# EAGLE design TSC_proiect (EAGLE 9.7.0)

## Sheet 1 of 2
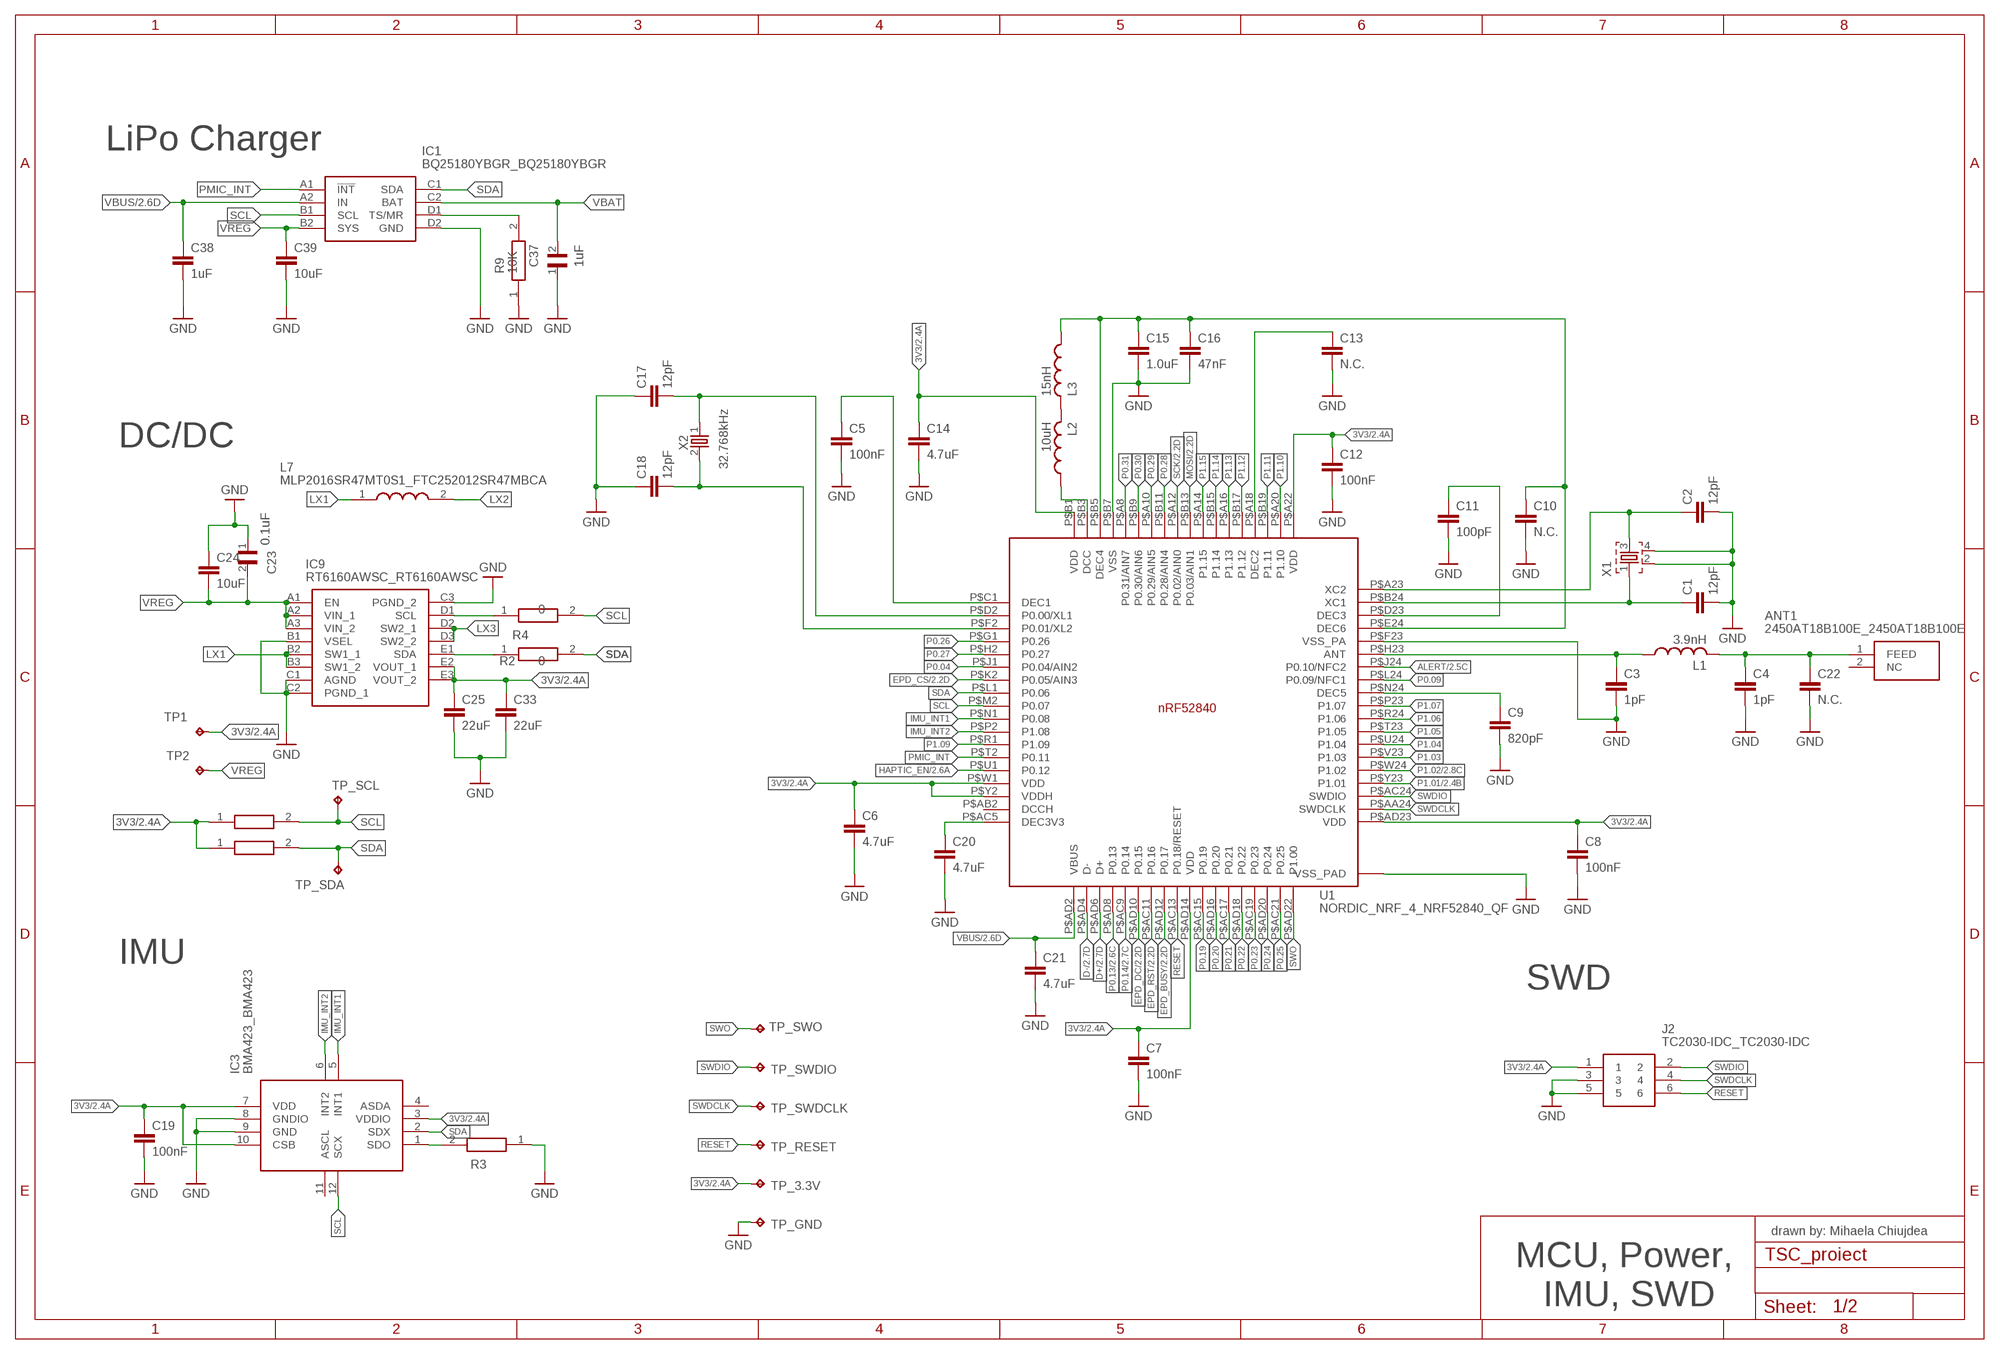
[diagram p0: schematic, sheet 1]

### Parts
ANT1  2450AT18B100E_2450AT18B100E  [2450AT18B100E_ANTC3216X140N]
C1  12pF  NORDIC_NRF_3_CAPACITOR_0201_L  [NORDIC_NRF_3_RESC0201_L]
C2  12pF  NORDIC_NRF_3_CAPACITOR_0201_L  [NORDIC_NRF_3_RESC0201_L]
C3  1pF  NORDIC_NRF_3_CAPACITOR_0201_L  [NORDIC_NRF_3_RESC0201_L]
C4  1pF  NORDIC_NRF_3_CAPACITOR_0201_L  [NORDIC_NRF_3_RESC0201_L]
C5  100nF  NORDIC_NRF_3_CAPACITOR_0201_L  [NORDIC_NRF_3_RESC0201_L]
C6  4.7uF  NORDIC_NRF_3_CAPACITOR_0201_L  [NORDIC_NRF_3_RESC0201_L]
C7  100nF  NORDIC_NRF_3_CAPACITOR_0201_L  [NORDIC_NRF_3_RESC0201_L]
C8  100nF  NORDIC_NRF_3_CAPACITOR_0201_L  [NORDIC_NRF_3_RESC0201_L]
C9  820pF  NORDIC_NRF_3_CAPACITOR_0201_L  [NORDIC_NRF_3_RESC0201_L]
C10  N.C.  NORDIC_NRF_3_CAPACITOR_0201_L  [NORDIC_NRF_3_RESC0201_L]
C11  100pF  NORDIC_NRF_3_CAPACITOR_0201_L  [NORDIC_NRF_3_RESC0201_L]
C12  100nF  NORDIC_NRF_3_CAPACITOR_0201_L  [NORDIC_NRF_3_RESC0201_L]
C13  N.C.  NORDIC_NRF_3_CAPACITOR_0201_L  [NORDIC_NRF_3_RESC0201_L]
C14  4.7uF  NORDIC_NRF_3_CAPACITOR_0201_L  [NORDIC_NRF_3_RESC0201_L]
C15  1.0uF  NORDIC_NRF_3_CAPACITOR_0201_L  [NORDIC_NRF_3_RESC0201_L]
C16  47nF  NORDIC_NRF_3_CAPACITOR_0201_L  [NORDIC_NRF_3_RESC0201_L]
C17  12pF  NORDIC_NRF_3_CAPACITOR_0201_L  [NORDIC_NRF_3_RESC0201_L]
C18  12pF  NORDIC_NRF_3_CAPACITOR_0201_L  [NORDIC_NRF_3_RESC0201_L]
C19  100nF  NORDIC_NRF_3_CAPACITOR_0201_L  [NORDIC_NRF_3_RESC0201_L]
C20  4.7uF  NORDIC_NRF_3_CAPACITOR_0201_L  [NORDIC_NRF_3_RESC0201_L]
C21  4.7uF  NORDIC_NRF_3_CAPACITOR_0201_L  [NORDIC_NRF_3_RESC0201_L]
C22  N.C.  NORDIC_NRF_3_CAPACITOR_0201_L  [NORDIC_NRF_3_RESC0201_L]
C23  0.1uF  GRM011R60J152KE01L_2_GRM011R60J152KE01L  [GRM011R60J152KE01L_2_CAPC0201X13N]
C24  10uF  NORDIC_NRF_3_CAPACITOR_0201_L  [NORDIC_NRF_3_RESC0201_L]
C25  22uF  NORDIC_NRF_3_CAPACITOR_0201_L  [NORDIC_NRF_3_RESC0201_L]
C33  22uF  NORDIC_NRF_3_CAPACITOR_0201_L  [NORDIC_NRF_3_RESC0201_L]
C37  1uF  GRM011R60J152KE01L_2_GRM011R60J152KE01L  [GRM011R60J152KE01L_2_CAPC0201X13N]
C38  1uF  NORDIC_NRF_3_CAPACITOR_0201_L  [NORDIC_NRF_3_RESC0201_L]
C39  10uF  NORDIC_NRF_3_CAPACITOR_0201_L  [NORDIC_NRF_3_RESC0201_L]
IC1  BQ25180YBGR_BQ25180YBGR  [BQ25180YBGR_BGA8C40P2X4_100X155X50]
IC3  BMA423_BMA423  [BMA423_BMA423]
IC9  RT6160AWSC_RT6160AWSC  [RT6160AWSC_BGA15C40P3X5_140X230X60]
J2  TC2030-IDC_TC2030-IDC  [TC2030-IDC_TC2030IDC]
L1  3.9nH  NORDIC_NRF_2_INDUCTOR_0402_L  [NORDIC_NRF_2_RESC0402_L]
L2  10uH  NORDIC_NRF_2_INDUCTOR_0402_L  [NORDIC_NRF_2_RESC0402_L]
L3  15nH  NORDIC_NRF_2_INDUCTOR_0402_L  [NORDIC_NRF_2_RESC0402_L]
L7  MLP2016SR47MT0S1_FTC252012SR47MBCA  [MLP2016SR47MT0S1_INDC2016X100N]
R2  0  CPF0201D7K68C1_CPF0201D7K68C1  [CPF0201D7K68C1_0201]
R3  CPF0201D7K68C1_CPF0201D7K68C1  [CPF0201D7K68C1_0201]
R4  0  CPF0201D7K68C1_CPF0201D7K68C1  [CPF0201D7K68C1_0201]
R9  10K  CPF0201D7K68C1_CPF0201D7K68C1  [CPF0201D7K68C1_0201]
R17  CPF0201D7K68C1_CPF0201D7K68C1  [CPF0201D7K68C1_0201]
R18  CPF0201D7K68C1_CPF0201D7K68C1  [CPF0201D7K68C1_0201]
TP1  HECTOR_WATCH_1_TPTP20R  [HECTOR_WATCH_1_TP20R]
TP2  HECTOR_WATCH_1_TPTP20R  [HECTOR_WATCH_1_TP20R]
TP_3.3V  HECTOR_WATCH_1_TPTP20R  [HECTOR_WATCH_1_TP20R]
TP_GND  HECTOR_WATCH_1_TPTP20R  [HECTOR_WATCH_1_TP20R]
TP_RESET  HECTOR_WATCH_1_TPTP20R  [HECTOR_WATCH_1_TP20R]
TP_SCL  HECTOR_WATCH_1_TPTP20R  [HECTOR_WATCH_1_TP20R]
TP_SDA  HECTOR_WATCH_1_TPTP20R  [HECTOR_WATCH_1_TP20R]
TP_SWDCLK  HECTOR_WATCH_1_TPTP20R  [HECTOR_WATCH_1_TP20R]
TP_SWDIO  HECTOR_WATCH_1_TPTP20R  [HECTOR_WATCH_1_TP20R]
TP_SWO  HECTOR_WATCH_1_TPTP20R  [HECTOR_WATCH_1_TP20R]
U1  NORDIC_NRF_4_NRF52840_QF  [NORDIC_NRF_4_AQFN50P700X700X85_HS-74N]
X1  NORDIC_NRF_XTAL_32MHZ  [NORDIC_NRF_BT-XTAL_2016_N]
X2  32.768kHz  NORDIC_NRF_1_XTAL_32KHZ  [NORDIC_NRF_1_XTAL_3215_N]

### Nets
3V3/2.4A: C6.1 C7.1 C8.1 C12.1 C14.1 C19.1 C25.1 C33.1 IC3.3(VDDIO) IC3.7(VDD) IC3.10(CSB) IC9.E2(VOUT_1) IC9.E3(VOUT_2) J2.1 R17.1 R18.1 TP1.TP TP_3.3V.TP U1.P$A22(VDD) U1.P$AD14(VDD) U1.P$AD23(VDD) U1.P$B1(VDD) U1.P$W1(VDD) U1.P$Y2(VDDH)
22UF: C25.2 C33.2 ; supply symbol labelled GND
ALERT/2.5C: U1.P$J24(P0.10/NFC2)
D+/2.7D: U1.P$AD6(D+)
D-/2.7D: U1.P$AD4(D-)
EPD_BUSY/2.2D: U1.P$AD12(P0.17)
EPD_CS/2.2D: U1.P$K2(P0.05/AIN3)
EPD_DC/2.2D: U1.P$AD10(P0.15)
EPD_RST/2.2D: U1.P$AC11(P0.16)
GND: C1.2 C2.2 C3.2 C4.2 C5.2 C6.2 C7.2 C8.2 C9.2 C10.2 C11.2 C12.2 C13.2 C14.2 C15.2 C16.2 C17.1 C18.1 C19.2 C20.2 C21.2 C22.2 C23.1 C24.1 C37.1 C38.2 C39.2 IC1.D2(GND) IC3.8(GNDIO) IC3.9(GND) IC9.B1(VSEL) IC9.C1(AGND) IC9.C2(PGND_1) IC9.C3(PGND_2) J2.3 J2.5 R3.1 R9.1 U1.P$74(VSS_PAD) U1.P$75(VSS_PAD) U1.P$76(VSS_PAD) U1.P$77(VSS_PAD) U1.P$78(VSS_PAD) U1.P$79(VSS_PAD) U1.P$80(VSS_PAD) U1.P$81(VSS_PAD) U1.P$82(VSS_PAD) U1.P$83(VSS_PAD) U1.P$84(VSS_PAD) U1.P$85(VSS_PAD) U1.P$86(VSS_PAD) U1.P$87(VSS_PAD) U1.P$88(VSS_PAD) U1.P$89(VSS_PAD) U1.P$90(VSS_PAD) U1.P$B7(VSS) U1.P$F23(VSS_PA) X1.2 X1.4 ; also sheet 2
HAPTIC_EN/2.6A: U1.P$U1(P0.12)
IMU_INT1: IC3.5(INT1) U1.P$N1(P0.08)
IMU_INT2: IC3.6(INT2) U1.P$P2(P1.08)
LX1: IC9.B2(SW1_1) IC9.B3(SW1_2) L7.1
LX2: L7.2
LX3: IC9.D2(SW2_1) IC9.D3(SW2_2)
MOSI/2.2D: U1.P$B13(P0.03/AIN1)
N$1: IC1.D1(TS/MR) R9.2
N$2: IC9.D1(SCL) R4.1
N$3: IC9.E1(SDA) R2.1
N$4: C20.1 U1.P$AC5(DEC3V3)
N$5: C9.1 U1.P$N24(DEC5)
N$6: C3.1 L1.1 U1.P$H23(ANT)
N$7: ANT1.1(FEED) C4.1 C22.1 L1.2
N$8: C1.1 U1.P$B24(XC1) X1.1
N$9: C2.1 U1.P$A23(XC2) X1.3
N$10: C11.1 U1.P$D23(DEC3)
N$11: C13.1 U1.P$A18(DEC2)
N$12: L2.2 L3.2
N$13: L2.1 U1.P$B3(DCC)
N$14: C10.1 C15.1 C16.1 L3.1 U1.P$B5(DEC4) U1.P$E24(DEC6)
N$15: C5.1 U1.P$C1(DEC1)
N$16: C17.2 U1.P$D2(P0.00/XL1) X2.1
N$17: C18.2 U1.P$F2(P0.01/XL2) X2.2
N$19: IC3.1(SDO) R3.2
N$24: TP_GND.TP ; supply symbol labelled GND
P0.04: U1.P$J1(P0.04/AIN2)
P0.09: U1.P$L24(P0.09/NFC1)
P0.13/2.6C: U1.P$AD8(P0.13)
P0.14/2.7C: U1.P$AC9(P0.14)
P0.19: U1.P$AC15(P0.19)
P0.20: U1.P$AD16(P0.20)
P0.21: U1.P$AC17(P0.21)
P0.22: U1.P$AD18(P0.22)
P0.23: U1.P$AC19(P0.23)
P0.24: U1.P$AD20(P0.24)
P0.25: U1.P$AC21(P0.25)
P0.26: U1.P$G1(P0.26)
P0.27: U1.P$H2(P0.27)
P0.28: U1.P$B11(P0.28/AIN4)
P0.29: U1.P$A10(P0.29/AIN5)
P0.30: U1.P$B9(P0.30/AIN6)
P0.31: U1.P$A8(P0.31/AIN7)
P1.01/2.4B: U1.P$Y23(P1.01)
P1.02/2.8C: U1.P$W24(P1.02)
P1.03: U1.P$V23(P1.03)
P1.04: U1.P$U24(P1.04)
P1.05: U1.P$T23(P1.05)
P1.06: U1.P$R24(P1.06)
P1.07: U1.P$P23(P1.07)
P1.09: U1.P$R1(P1.09)
P1.10: U1.P$A20(P1.10)
P1.11: U1.P$B19(P1.11)
P1.12: U1.P$B17(P1.12)
P1.13: U1.P$A16(P1.13)
P1.14: U1.P$B15(P1.14)
P1.15: U1.P$A14(P1.15)
PMIC_INT: IC1.A1(!INT) U1.P$T2(P0.11)
RESET: J2.6 TP_RESET.TP U1.P$AC13(P0.18/RESET)
SCK/2.2D: U1.P$A12(P0.02/AIN0)
SCL: IC1.B1(SCL) IC3.12(SCX) R4.2 R17.2 TP_SCL.TP U1.P$M2(P0.07)
SDA: IC1.C1(SDA) IC3.2(SDX) R2.2 R18.2 TP_SDA.TP U1.P$L1(P0.06)
SWDCLK: J2.4 TP_SWDCLK.TP U1.P$AA24(SWDCLK)
SWDIO: J2.2 TP_SWDIO.TP U1.P$AC24(SWDIO)
SWO: TP_SWO.TP U1.P$AD22(P1.00)
VBAT: C37.2 IC1.C2(BAT)
VBUS/2.6D: C21.1 C38.1 IC1.A2(IN) U1.P$AD2(VBUS)
VREG: C23.2 C24.2 C39.1 IC1.B2(SYS) IC9.A1(EN) IC9.A2(VIN_1) IC9.A3(VIN_2) TP2.TP
Unconnected: ANT1.2(NC) IC3.4(ASDA) IC3.11(ASCL) U1.P$AB2(DCCH)

### Notes on the sheet
- LiPo Charger
- DC/DC
- IMU
- SWD
- drawn by: Mihaela Chiujdea
- MCU, Power, 
  IMU, SWD

## Sheet 2 of 2
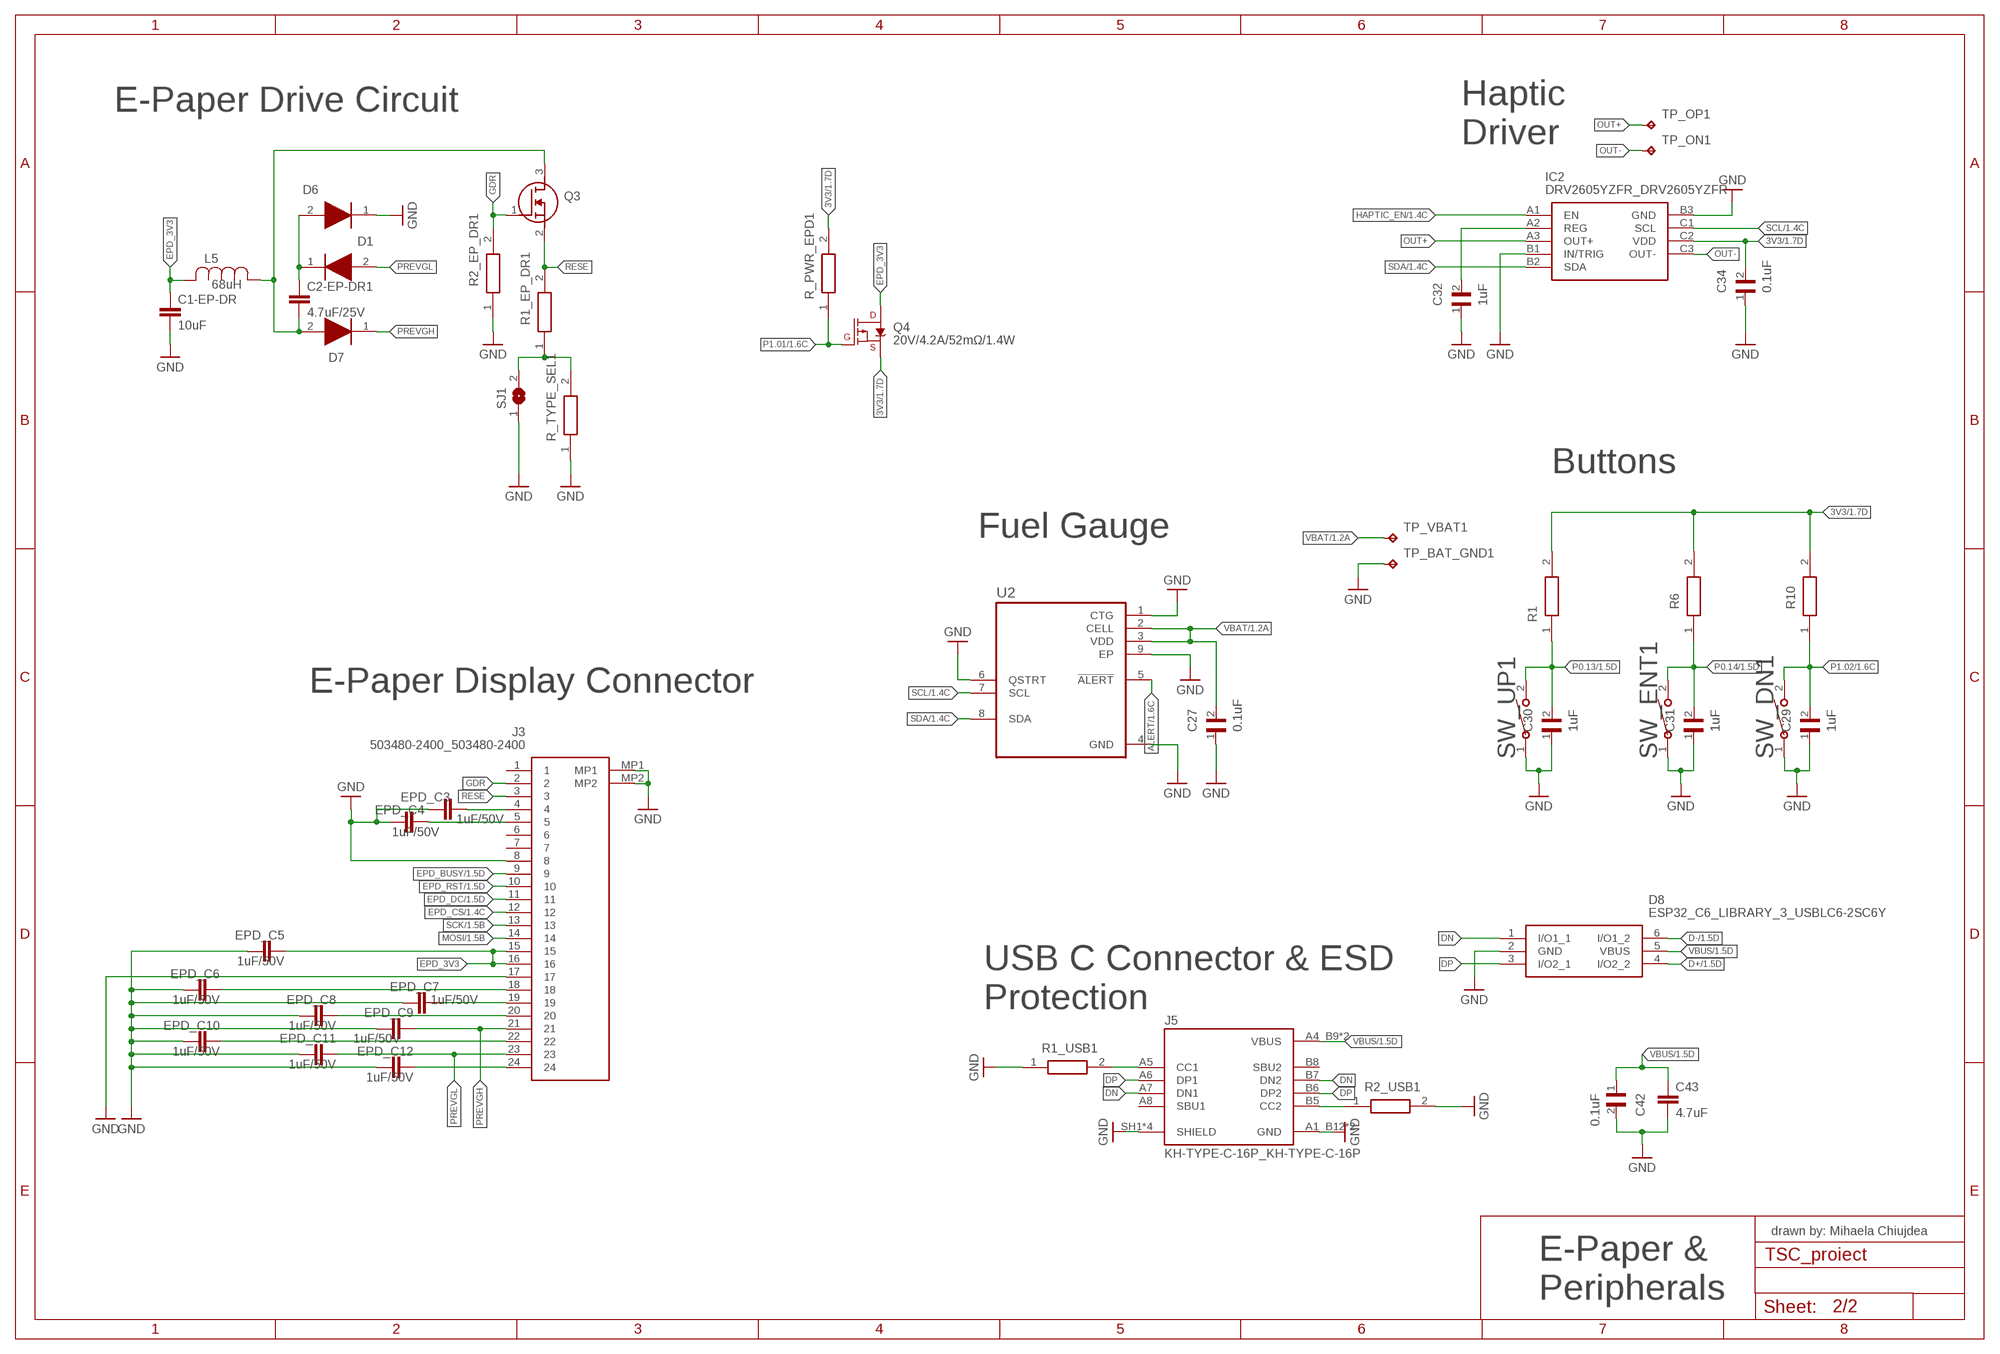
[diagram p1: schematic, sheet 2]

### Parts
C1-EP-DR  10uF  NORDIC_NRF_3_CAPACITOR_0201_L  [NORDIC_NRF_3_RESC0201_L]
C2-EP-DR1  4.7uF/25V  NORDIC_NRF_3_CAPACITOR_0201_L  [NORDIC_NRF_3_RESC0201_L]
C27  0.1uF  GRM011R60J152KE01L_2_GRM011R60J152KE01L  [GRM011R60J152KE01L_2_CAPC0201X13N]
C29  1uF  GRM011R60J152KE01L_2_GRM011R60J152KE01L  [GRM011R60J152KE01L_2_CAPC0201X13N]
C30  1uF  GRM011R60J152KE01L_2_GRM011R60J152KE01L  [GRM011R60J152KE01L_2_CAPC0201X13N]
C31  1uF  GRM011R60J152KE01L_2_GRM011R60J152KE01L  [GRM011R60J152KE01L_2_CAPC0201X13N]
C32  1uF  GRM011R60J152KE01L_2_GRM011R60J152KE01L  [GRM011R60J152KE01L_2_CAPC0201X13N]
C34  0.1uF  GRM011R60J152KE01L_2_GRM011R60J152KE01L  [GRM011R60J152KE01L_2_CAPC0201X13N]
C42  0.1uF  GRM011R60J152KE01L_2_GRM011R60J152KE01L  [GRM011R60J152KE01L_2_CAPC0201X13N]
C43  4.7uF  NORDIC_NRF_3_CAPACITOR_0201_L  [NORDIC_NRF_3_RESC0201_L]
D1  ESP32_C6_LIBRARY_5_MBR0530  [ESP32_C6_LIBRARY_5_SOD3716X135N]
D6  ESP32_C6_LIBRARY_5_MBR0530  [ESP32_C6_LIBRARY_5_SOD3716X135N]
D7  ESP32_C6_LIBRARY_5_MBR0530  [ESP32_C6_LIBRARY_5_SOD3716X135N]
D8  ESP32_C6_LIBRARY_3_USBLC6-2SC6Y  [ESP32_C6_LIBRARY_3_SOT95P280X145-6N]
EPD_C3  1uF/50V  NORDIC_NRF_3_CAPACITOR_0201_L  [NORDIC_NRF_3_RESC0201_L]
EPD_C4  1uF/50V  NORDIC_NRF_3_CAPACITOR_0201_L  [NORDIC_NRF_3_RESC0201_L]
EPD_C5  1uF/50V  NORDIC_NRF_3_CAPACITOR_0201_L  [NORDIC_NRF_3_RESC0201_L]
EPD_C6  1uF/50V  NORDIC_NRF_3_CAPACITOR_0201_L  [NORDIC_NRF_3_RESC0201_L]
EPD_C7  1uF/50V  NORDIC_NRF_3_CAPACITOR_0201_L  [NORDIC_NRF_3_RESC0201_L]
EPD_C8  1uF/50V  NORDIC_NRF_3_CAPACITOR_0201_L  [NORDIC_NRF_3_RESC0201_L]
EPD_C9  1uF/50V  NORDIC_NRF_3_CAPACITOR_0201_L  [NORDIC_NRF_3_RESC0201_L]
EPD_C10  1uF/50V  NORDIC_NRF_3_CAPACITOR_0201_L  [NORDIC_NRF_3_RESC0201_L]
EPD_C11  1uF/50V  NORDIC_NRF_3_CAPACITOR_0201_L  [NORDIC_NRF_3_RESC0201_L]
EPD_C12  1uF/50V  NORDIC_NRF_3_CAPACITOR_0201_L  [NORDIC_NRF_3_RESC0201_L]
IC2  DRV2605YZFR_DRV2605YZFR  [DRV2605YZFR_BGA9C50P3X3_144X144X62]
J3  503480-2400_503480-2400  [503480-2400_5034802400]
J5  KH-TYPE-C-16P_KH-TYPE-C-16P  [KH-TYPE-C-16P_KINGHELM_KH-TYPE-C-16P]
L5  68uH  ESP32_C6_LIBRARY_2_744043680IND_4828-WE-TPC_WRE  [ESP32_C6_LIBRARY_2_IND_4828-WE-TPC_WRE]
Q3  ESP32_C6_LIBRARY_6_SI1308EDL-T1-GE3  [ESP32_C6_LIBRARY_6_SOT65P210X110-3N]
Q4  20V/4.2A/52mΩ/1.4W  ESP32_C6_LIBRARY_4_ESP32_WROVER_SPARKFUN-DISCRETESEMI_MOSFET_PCH-DMG2305UX-7  [ESP32_C6_LIBRARY_4_ESP32_C6_LIBRARY_4_ESP32_C6_LIBRARY_4_ESP32_C6_LIBRARY_4_ESP32_WROVER_SPARKFUN-DISCRETESEMI_SOT23-3]
R1  CPF0201D7K68C1_CPF0201D7K68C1  [CPF0201D7K68C1_0201]
R1_EP_DR1  CPF0201D7K68C1_CPF0201D7K68C1  [CPF0201D7K68C1_0201]
R1_USB1  5K1  CPF0201D7K68C1_CPF0201D7K68C1  [CPF0201D7K68C1_0201]
R2_EP_DR1  CPF0201D7K68C1_CPF0201D7K68C1  [CPF0201D7K68C1_0201]
R2_USB1  CPF0201D7K68C1_CPF0201D7K68C1  [CPF0201D7K68C1_0201]
R6  CPF0201D7K68C1_CPF0201D7K68C1  [CPF0201D7K68C1_0201]
R10  CPF0201D7K68C1_CPF0201D7K68C1  [CPF0201D7K68C1_0201]
R_PWR_EPD1  CPF0201D7K68C1_CPF0201D7K68C1  [CPF0201D7K68C1_0201]
R_TYPE_SEL1  CPF0201D7K68C1_CPF0201D7K68C1  [CPF0201D7K68C1_0201]
SJ1  ESP32_C6_LIBRARY_7_JUMPER_SJ  [ESP32_C6_LIBRARY_7_JUMPER_SJ]
SW_DN1  2025-10-22_07-23-44_LIBRARY_EVP-AKE31ASW_EVP-AKE31A_PAN  [2025-10-22_07-23-44_LIBRARY_SW_EVP-AKE31A_PAN]
SW_ENT1  2025-10-22_07-23-44_LIBRARY_EVP-AKE31ASW_EVP-AKE31A_PAN  [2025-10-22_07-23-44_LIBRARY_SW_EVP-AKE31A_PAN]
SW_UP1  2025-10-22_07-23-44_LIBRARY_EVP-AKE31ASW_EVP-AKE31A_PAN  [2025-10-22_07-23-44_LIBRARY_SW_EVP-AKE31A_PAN]
TP_BAT_GND1  HECTOR_WATCH_1_TPTP20R  [HECTOR_WATCH_1_TP20R]
TP_ON1  HECTOR_WATCH_1_TPTP20R  [HECTOR_WATCH_1_TP20R]
TP_OP1  HECTOR_WATCH_1_TPTP20R  [HECTOR_WATCH_1_TP20R]
TP_VBAT1  HECTOR_WATCH_1_TPTP20R  [HECTOR_WATCH_1_TP20R]
U2  ESP32_C6_LIBRARY_MAX17048G+T10  [ESP32_C6_LIBRARY_SON50P200X200X80-9N]

### Nets
3V3/1.7D: C34.2 IC2.C2(VDD) Q4.2(S) R1.2 R6.2 R10.2 R_PWR_EPD1.2
ALERT/1.6C: U2.5(!ALERT)
D+/1.5D: D8.4(I/O2_2)
D-/1.5D: D8.6(I/O1_2)
DN: D8.1(I/O1_1) J5.A7(DN1) J5.B7(DN2)
DP: D8.3(I/O2_1) J5.A6(DP1) J5.B6(DP2)
EPD_3V3: C1-EP-DR.1 EPD_C5.2 J3.15 J3.16 L5.2 Q4.3(D)
EPD_BUSY/1.5D: J3.9
EPD_CS/1.4C: J3.12
EPD_DC/1.5D: J3.11
EPD_RST/1.5D: J3.10
GDR: J3.2 Q3.1(G) R2_EP_DR1.2
GND: C1-EP-DR.2 C27.1 C29.1 C30.1 C31.1 C32.1 C34.1 C42.2 C43.2 D6.1(K) D8.2(GND) EPD_C3.1 EPD_C4.1 EPD_C5.1 EPD_C6.1 EPD_C7.1 EPD_C8.1 EPD_C9.1 EPD_C10.1 EPD_C11.1 EPD_C12.1 IC2.B1(IN/TRIG) IC2.B3(GND) J3.8 J3.17 J3.MP1 J3.MP2 J5.A1_B12(GND) J5.A12_B1(GND) J5.SH1(SHIELD) J5.SH2(SHIELD) J5.SH3(SHIELD) J5.SH4(SHIELD) R1_USB1.1 R2_EP_DR1.1 R2_USB1.2 R_TYPE_SEL1.1 SJ1.1 SW_DN1.1 SW_ENT1.1 SW_UP1.1 TP_BAT_GND1.TP U2.1(CTG) U2.4(GND) U2.6(QSTRT) U2.9(EP) ; also sheet 1
HAPTIC_EN/1.4C: IC2.A1(EN)
MOSI/1.5B: J3.14
N$30: C2-EP-DR1.2 D7.2(A) L5.1 Q3.3(D)
N$32: C2-EP-DR1.1 D1.1(K) D6.2(A)
N$35: R1_EP_DR1.1 R_TYPE_SEL1.2 SJ1.2
N$36: C32.2 IC2.A2(REG)
N$37: EPD_C4.2 J3.5
N$38: EPD_C3.2 J3.4
N$39: EPD_C6.2 J3.18
N$40: EPD_C7.2 J3.19
N$41: EPD_C8.2 J3.20
N$42: EPD_C10.2 J3.22
N$43: EPD_C12.2 J3.24
N$44: J5.A5(CC1) R1_USB1.2
N$45: J5.B5(CC2) R2_USB1.1
OUT+: IC2.A3(OUT+) TP_OP1.TP
OUT-: IC2.C3(OUT-) TP_ON1.TP
P0.13/1.5D: C30.2 R1.1 SW_UP1.2
P0.14/1.5D: C31.2 R6.1 SW_ENT1.2
P1.01/1.6C: Q4.1(G) R_PWR_EPD1.1
P1.02/1.6C: C29.2 R10.1 SW_DN1.2
PREVGH: D7.1(K) EPD_C9.2 J3.21
PREVGL: D1.2(A) EPD_C11.2 J3.23
RESE: J3.3 Q3.2(S) R1_EP_DR1.2
SCK/1.5B: J3.13
SCL/1.4C: IC2.C1(SCL) U2.7(SCL)
SDA/1.4C: IC2.B2(SDA) U2.8(SDA)
VBAT/1.2A: C27.2 TP_VBAT1.TP U2.2(CELL) U2.3(VDD)
VBUS/1.5D: C42.1 C43.1 D8.5(VBUS) J5.A4_B9(VBUS) J5.A9_B4(VBUS)
Unconnected: J3.1 J3.6 J3.7 J5.A8(SBU1) J5.B8(SBU2)

### Notes on the sheet
- E-Paper Drive Circuit
- Haptic
  Driver
- Buttons
- Fuel Gauge
- E-Paper Display Connector
- USB C Connector & ESD
  Protection
- drawn by: Mihaela Chiujdea
- E-Paper &
  Peripherals

## Library data of the parts
ANT1 = InkTime_v5:2450AT18B100E_2450AT18B100E: Antennas 2.45GHz ANTENNA Source: Datasheet <https://www.johansontechnology.com/datasheets/2450AT18B100/2450AT18B100.pdf>
C1 C1-EP-DR C2 C2-EP-DR1 C3-C22 C24 C25 C33 C38 C39 C43 EPD_C3-EPD_C12 = InkTime_v5:NORDIC_NRF_3_CAPACITOR: Generic chip capacitor
C23 C27 C29-C32 C34 C37 C42 = InkTime_v5:GRM011R60J152KE01L_2_GRM011R60J152KE01L: Check availability <https://pricing.snapeda.com/parts/GRM011R60J152KE01L/Murata/view-part?ref=eda>
D1 D6 D7 = InkTime_v5:ESP32_C6_LIBRARY_5_MBR0530: ON SEMICONDUCTOR - MBR0530 - DIODE, SCHOTTKY, 0.5A, 30V, SOD-123 Source: Datasheet <http://www.onsemi.com/pub/Collateral/MBR0530T1-D.PDF> Check availability <https://pricing.snapeda.com/parts/MBR0530/ON%20Semiconductor/view-part?ref=eda>
D8 = InkTime_v5:ESP32_C6_LIBRARY_3_USBLC6-2SC6Y: Low Cap. ESD Protection Auto SOT-23-6 STMicroelectronics USBLC6-2SC6Y, Dual Uni-Directional TVS Diode Array, 6-Pin SOT-23 Source: Datasheet <https://componentsearchengine.com/Datasheets/1/USBLC6-2SC6Y.pdf> Check availability <https://pricing.snapeda.com/parts/USBLC6-2SC6Y/STMicroelectronics/view-part?ref=eda>
IC1 = InkTime_v5:BQ25180YBGR_BQ25180YBGR: Charger IC Lithium Ion/Polymer, Lithium Iron Phosphate 8-DSBGA (1.6x1.1) Source: Datasheet <https://www.ti.com/lit/ds/symlink/bq25180.pdf?ts=1650264094470&ref_url=https%3A%2F%2Fwww.ti.com%2Fproduct%2FBQ25180>
IC2 = InkTime_v5:DRV2605YZFR_DRV2605YZFR: Haptic Driver for ERM/LRA with Built-In Library and Smart Loop Architecture Source: Datasheet <http://www.ti.com/lit/gpn/drv2605>
IC3 = InkTime_v5:BMA423_BMA423: Accelerometers Triaxial low-g 12bit Acceleration Sensor Source: Datasheet <https://www.mouser.com/datasheet/2/783/BST-BMA423-DS000-1509600.pdf>
IC9 = InkTime_v5:RT6160AWSC_RT6160AWSC: Buck-Boost Regulator Positive Output Step-Up/Step-Down I2C DC-DC Controller IC 15-WL-CSP (BSC) (1.4x2.3) Source: Datasheet <https://www.richtek.com/SaveDownload.aspx?specid=RT6160A>
J2 = InkTime_v5:TC2030-IDC_TC2030-IDC: CABLE ADAPTER 6 POS Source: Datasheet <https://datasheet.datasheetarchive.com/originals/distributors/Datasheets_SAMA/62bc384e093448baaaa63dbd0b9d8707.pdf>
J3 = InkTime_v5:503480-2400_503480-2400: FFC & FPC Connectors 0.5mm FPC RA SMT Dual Contact 24Ckt Source: Datasheet <https://componentsearchengine.com/Datasheets/1/503480-2400.pdf>
J5 = InkTime_v5:KH-TYPE-C-16P_KH-TYPE-C-16P: Check availability <https://pricing.snapeda.com/parts/KH-TYPE-C-16P/kinghelm/view-part?ref=eda>
L1-L3 = InkTime_v5:NORDIC_NRF_2_INDUCTOR: Generic chip inductor
L5 = InkTime_v5:ESP32_C6_LIBRARY_2_744043680
L7 = InkTime_v5:MLP2016SR47MT0S1_FTC252012SR47MBCA: SMD / SMT Inductors (Coils), L=0.47?H, L x W x T : Source: Datasheet <https://product.tdk.com/system/files/dam/doc/product/inductor/inductor/smd/catalog/inductor_commercial_power_mlp2016_en.pdf>
Q3 = InkTime_v5:ESP32_C6_LIBRARY_6_SI1308EDL-T1-GE3: MOSFET N-Ch 30V 1.5A TrenchFET SC70 Vishay Si1308EDL-T1-GE3 N-channel MOSFET Transistor, 1.5 A, 30 V, 3-Pin SC-70 Source: Datasheet <https://componentsearchengine.com/Datasheets/1/SI1308EDL-T1-GE3.pdf> Check availability <https://pricing.snapeda.com/parts/SI1308EDL-T1-GE3/Vishay%20Siliconix/view-part?ref=eda>
Q4 = InkTime_v5:ESP32_C6_LIBRARY_4_ESP32_WROVER_SPARKFUN-DISCRETESEMI_MOSFET_PCH: P-channel MOSFETs Voltage controlled devices that allow control of high current outputs. SparkFun Products: SparkFun ESP32 Thing <https://www.sparkfun.com/products/13907> SparkFun ESP8266 Thing <https://www.sparkfun.com/products/13231> SparkFun Pi Servo HAT V2 <https://www.sparkfun.com/products/15316> DMG2305UX-7 (20V/4.2A/SOT23-3)
R1 R1_EP_DR1 R1_USB1 R2 R2_EP_DR1 R2_USB1 R3 R4 R6 R9 R10 R17 R18 R_PWR_EPD1 R_TYPE_SEL1 = InkTime_v5:CPF0201D7K68C1_CPF0201D7K68C1: 7.68k 0201 Thin Film Surface Mount Fixed Resistor +/-0.5% 0.031W CPF0201D7K68C1 Source: Datasheet <http://www.te.com/commerce/DocumentDelivery/DDEController?Action=showdoc&DocId=Data Sheet1773200-1ApdfEnglishENG_DS_1773200-1_A.pdf4-2176215-6>
SJ1 = InkTime_v5:ESP32_C6_LIBRARY_7_JUMPER_SJ: SMD solder JUMPER
SW_DN1 SW_ENT1 SW_UP1 = InkTime_v5:2025-10-22_07-23-44_LIBRARY_EVP-AKE31A
TP1 TP2 TP_3.3V TP_BAT_GND1 TP_GND TP_ON1 TP_OP1 TP_RESET TP_SCL TP_SDA TP_SWDCLK TP_SWDIO TP_SWO TP_VBAT1 = InkTime_v5:HECTOR_WATCH_1_TP: Test pad
U1 = InkTime_v5:NORDIC_NRF_4_NRF52840_QF: nRF52840 Features Advanced Single chip 2.4 GHz multi-protocol SoC 32-bit ARM Cortex-M4F Processor 1.7v to 5.5v operation 1MB flash + 256kB RAM Bluetooth 5 support for long range and high throughput 802.15.4 radio support On-chip NFC PPI –Programmable Peripheral Interconnect Automated power management system with automatic power management of each peripheral Configurable I/O mapping for analog and digital I/O 48 x GPIO 1 x QSPI 4 x Master/Slave SPI 2 x Two-wire interface (I²C) I²S interface 2 x UART 4 x PWM USB 2.0 controller ARM TrustZone CryptoCell-310 Cryptographic and security module AES 128-bit ECB/CCM/AAR hardware accelerator Digital microphone interface (PDM) Quadrature decoder 12-bit ADC Low power comparator On-chip 50Ω balun On-air compatible with nRF52, nRF51 and nRF24 Series Applications Advanced high performance wearables Wearables for secure payments Virtual Reality/Augmented Reality systems Smart Home sensor networks Smart city sensor networks High performance HID controllers Internet of Things (IoT) sensor networks Smart door locks Smart lighting networks Connected white goods
U2 = InkTime_v5:ESP32_C6_LIBRARY_MAX17048G+T10: Check availability <https://pricing.snapeda.com/parts/MAX17048G%2BT10/Analog%20Devices/view-part?ref=eda>
X1 = InkTime_v5:NORDIC_NRF_XTAL_32MHZ
X2 = InkTime_v5:NORDIC_NRF_1_XTAL_32KHZ

## Board
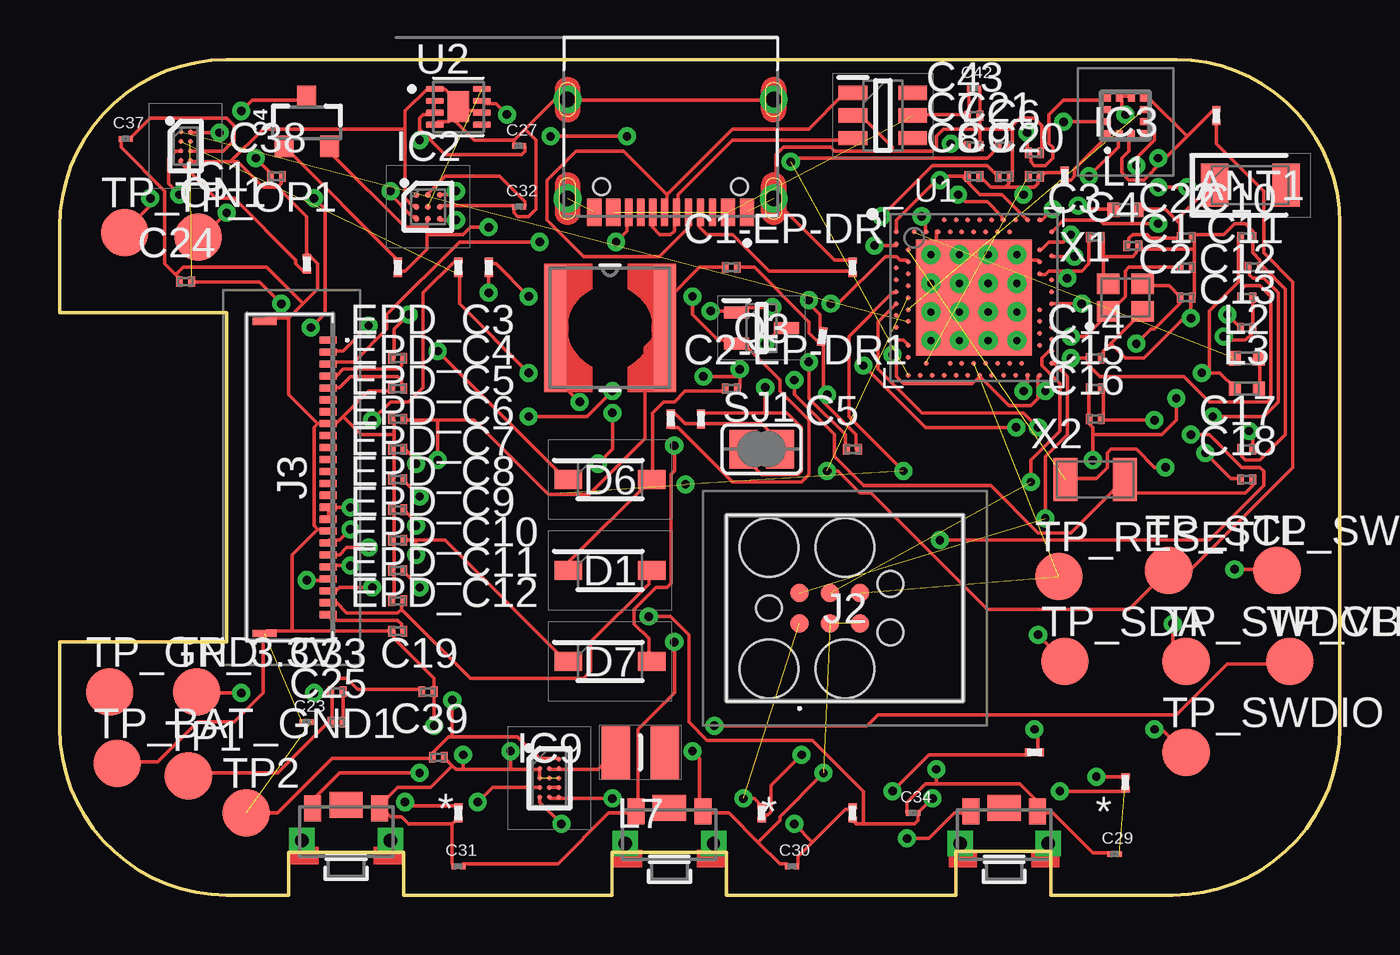
[diagram p2: board, top side]
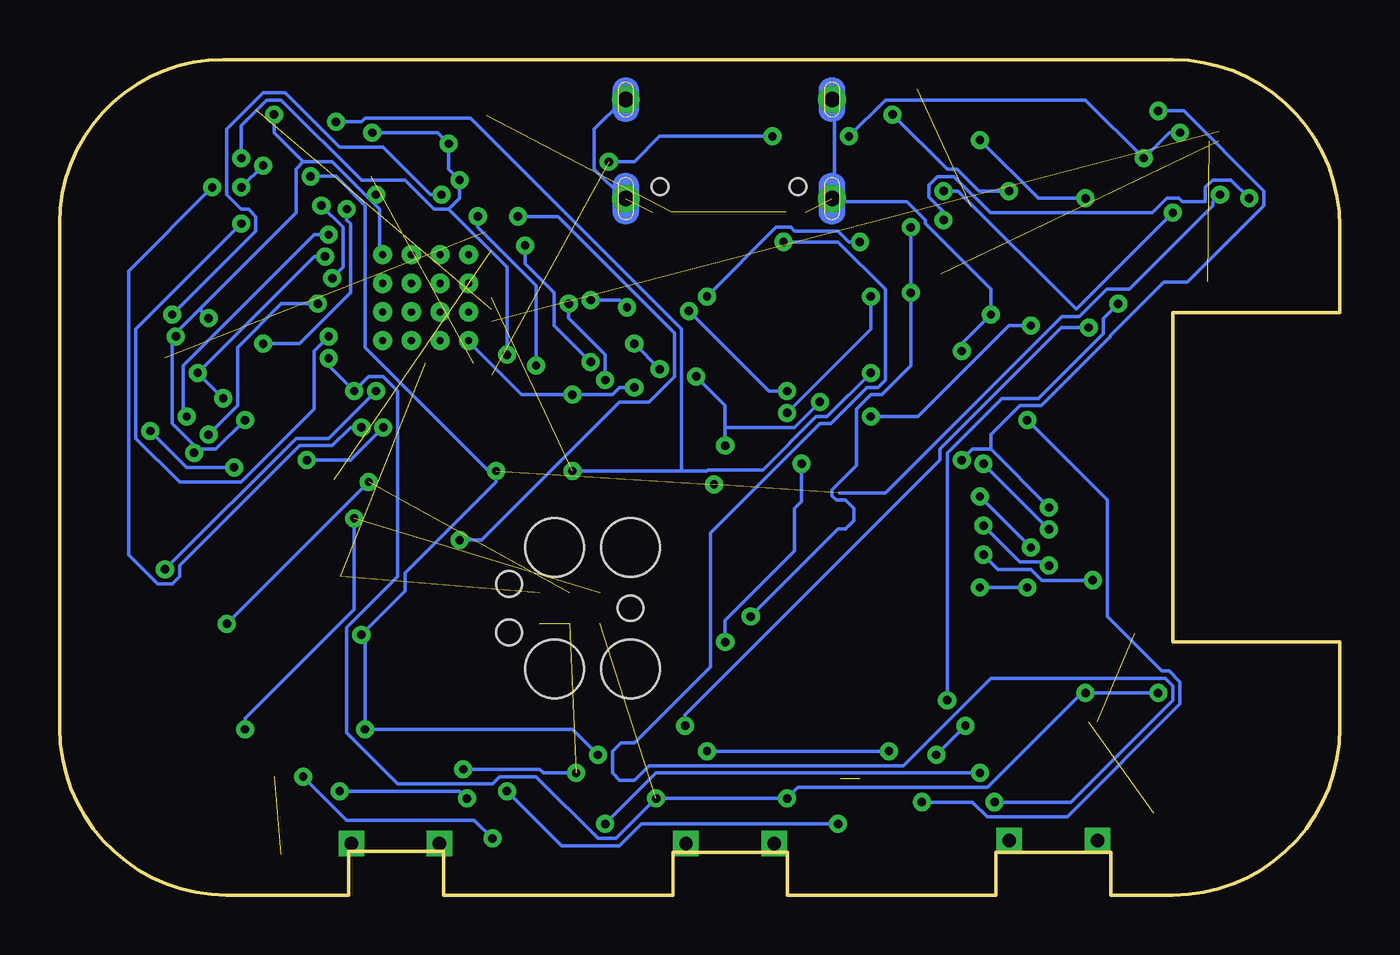
[diagram p3: board, bottom side, seen from below]

Size 53.62 x 35 mm. Coordinates in mm from the lower left corner, seen from the top.
Outline: 46.62,0 41.51,0 41.51,1.83 37.54,1.83 37.54,0 27.94,0 27.94,1.8 23.14,1.8 23.14,0 14.4,0 14.4,1.8 9.6,1.8 9.6,0 7,0 arc-90 0,7 0,10.6 7,10.6 7,24.4 0,24.4 0,28 arc-90 7,35 46.78,35 arc-90 53.62,28.16 53.62,7 arc-90 46.62,0
Copper layers (1*16): Top / Bottom
Stack-up Default Layer Stack: Top SilkScreen Epoxy Ink / Top SolderMask SR:Green 0.0254mm Dk 4.3 / Top Surface Finish Lead-Free 0.02mm / Top CuFoil:007 0.035mm / Dielectric-1 User Defined 1.5mm / Bottom CuFoil:007 0.035mm / Bottom Surface Finish Lead-Free 0.02mm / Bottom SolderMask SR:Green 0.0254mm Dk 4.3 / Bottom SilkScreen Epoxy Ink
Design rules: minimum copper width 6mil, minimum drill size 0.35mm, copper clearance wire_polygon to wire_polygon 6mil, copper clearance wire_polygon to pad_smd 6mil, copper clearance wire_polygon to via 6mil, copper clearance pad_smd to pad_smd 6mil, copper clearance pad_smd to via 6mil, copper clearance via to via 6mil, copper clearance smd to pad (same net) 6mil, copper clearance smd to via (same net) 6mil, copper clearance smd to smd (same net) 6mil, dimension clearance 40mil, via restrict clearance 0mil, restrict clearance 0mil, drill distance 6mil, keepout clearance 0mil

### Footprints (pad centres in the part's own frame; a part is rotated, then mirrored left to right if it is on the bottom)
2450AT18B100E_ANTC3216X140N = smd 1.15 x 1.8: 1 -1.5,0; 2 1.5,0
NORDIC_NRF_3_RESC0201_L = smd 0.28 x 0.43: 1 -0.255,0; 2 0.255,0
GRM011R60J152KE01L_2_CAPC0201X13N = smd 0.22 x 0.23: 1 -0.185,0; 2 0.185,0
ESP32_C6_LIBRARY_5_SOD3716X135N = smd 1.15 x 0.8: 1 -1.75,0; 2 1.75,0
ESP32_C6_LIBRARY_3_SOT95P280X145-6N = smd 1.2 x 0.6: 1 -1.25,0.95; 2 -1.25,0; 3 -1.25,-0.95; 4 1.25,-0.95; 5 1.25,0; 6 1.25,0.95
BQ25180YBGR_BGA8C40P2X4_100X155X50 = smd 0.2 x 0.2: A1 -0.2,0.6; A2 0.2,0.6; B1 -0.2,0.2; B2 0.2,0.2; C1 -0.2,-0.2; C2 0.2,-0.2; D1 -0.2,-0.6; D2 0.2,-0.6
DRV2605YZFR_BGA9C50P3X3_144X144X62 = smd 0.25 x 0.25: A1 -0.5,0.5; A2 0,0.5; A3 0.5,0.5; B1 -0.5,0; B2 0,0; B3 0.5,0; C1 -0.5,-0.5; C2 0,-0.5; C3 0.5,-0.5
BMA423_BMA423 = smd 0.3 x 0.35: 1 -0.75,-0.775; 2 -0.25,-0.775; 3 0.25,-0.775; 4 0.75,-0.775; 7 0.75,0.775; 8 0.25,0.775; 9 -0.25,0.775; 10 -0.75,0.775 | smd 0.35 x 0.3: 5 0.775,-0.25; 6 0.775,0.25; 11 -0.775,0.25; 12 -0.775,-0.25
RT6160AWSC_BGA15C40P3X5_140X230X60 = smd 0.216 x 0.216: A1 -0.4,0.8; A2 0,0.8; A3 0.4,0.8; B1 -0.4,0.4; B2 0,0.4; B3 0.4,0.4; C1 -0.4,0; C2 0,0; C3 0.4,0; D1 -0.4,-0.4; D2 0,-0.4; D3 0.4,-0.4; E1 -0.4,-0.8; E2 0,-0.8; E3 0.4,-0.8
TC2030-IDC_TC2030IDC = smd 0.783 x 0.783: 1 -0.953,-0.635; 2 -0.953,0.635; 3 0.317,-0.635; 4 0.317,0.635; 5 1.588,-0.635; 6 1.588,0.635 | hole 2.451: -2.223,-2.54; -2.223,2.54; 0.952,-2.54; 0.952,2.54 | hole 1.067: -2.223,0; 2.857,-1.016; 2.857,1.016
503480-2400_5034802400 = smd 0.3 x 0.7: 1 -5.75,1.525; 2 -5.25,1.525; 3 -4.75,1.525; 4 -4.25,1.525; 5 -3.75,1.525; 6 -3.25,1.525; 7 -2.75,1.525; 8 -2.25,1.525; 9 -1.75,1.525; 10 -1.25,1.525; 11 -0.75,1.525; 12 -0.25,1.525; 13 0.25,1.525; 14 0.75,1.525; 15 1.25,1.525; 16 1.75,1.525; 17 2.25,1.525; 18 2.75,1.525; 19 3.25,1.525; 20 3.75,1.525; 21 4.25,1.525; 22 4.75,1.525; 23 5.25,1.525; 24 5.75,1.525 | smd 0.3 x 1: MP1 -6.54,-1.125; MP2 6.54,-1.125
KH-TYPE-C-16P_KINGHELM_KH-TYPE-C-16P = smd 0.6 x 1.15: A1_B12 -3.2,4.725; A4_B9 -2.4,4.725; A9_B4 2.4,4.725; A12_B1 3.2,4.725 | smd 0.3 x 1.15: A5 -1.25,4.725; A6 -0.25,4.725; A7 0.25,4.725; A8 1.25,4.725; B5 1.75,4.725; B6 0.75,4.725; B7 -0.75,4.725; B8 -1.75,4.725 | drill 0.65 pad 1.05: SH1 -4.32,0; SH2 4.32,0; SH3 -4.32,4.15; SH4 4.32,4.15 | hole 0.7: -2.89,3.65; 2.89,3.65
NORDIC_NRF_2_RESC0402_L = smd 0.5 x 0.6: 1 -0.5,0; 2 0.5,0
ESP32_C6_LIBRARY_2_IND_4828-WE-TPC_WRE = smd 0.9 x 5.3: 1 -2.286,0; 2 2.286,0
MLP2016SR47MT0S1_INDC2016X100N = smd 1.2 x 2.2: 1 -1.028,0; 2 1.028,0
ESP32_C6_LIBRARY_6_SOT65P210X110-3N = smd 1.05 x 0.5: 1 -1.05,0.65; 2 -1.05,-0.65; 3 1.05,0
ESP32_C6_LIBRARY_4_ESP32_C6_LIBRARY_4_ESP32_C6_LIBRARY_4_ESP32_C6_LIBRARY_4_ESP32_WROVER_SPARKFUN-DISCRETESEMI_SOT23-3 = smd 0.8 x 0.9: 1 -0.95,-1; 2 0.95,-1; 3 0,1.1
CPF0201D7K68C1_0201 = smd 0.35 x 0.25: 1 0,0.275; 2 0,-0.275
ESP32_C6_LIBRARY_7_JUMPER_SJ = smd 1.168 x 1.6: 1 -0.762,0; 2 0.762,0
2025-10-22_07-23-44_LIBRARY_SW_EVP-AKE31A_PAN = smd 0.711 x 1.092: 1 -1.4,-0.972; 2 1.4,-0.972 | drill 0.559 pad 0.914 square: 3 -1.848,0.381; 4 1.848,0.381 | smd 1.397 x 1.092: 5 0,-1.124
HECTOR_WATCH_1_TP20R = smd 2 x 2: TP 0,0
NORDIC_NRF_4_AQFN50P700X700X85_HS-74N = smd 4.85 x 4.85: P$74 0,0 | drill 0.3 pad 0.6: P$75 -1.8,1.8; P$76 -0.6,1.8; P$77 0.6,1.8; P$78 1.8,1.8; P$79 -1.8,0.6; P$80 -0.6,0.6; P$81 0.6,0.6; P$82 1.8,0.6; P$83 -1.8,-0.6; P$84 -0.6,-0.6; P$85 0.6,-0.6; P$86 1.8,-0.6; P$87 -1.8,-1.8; P$88 -0.6,-1.8; P$89 0.6,-1.8; P$90 1.8,-1.8 | smd 0.2 x 0.2: P$A8 -1.25,3.25; P$A10 -0.75,3.25; P$A12 -0.25,3.25; P$A14 0.25,3.25; P$A16 0.75,3.25; P$A18 1.25,3.25; P$A20 1.75,3.25; P$A22 2.25,3.25; P$A23 2.75,3.25; P$AA24 3.25,-2.25; P$AB2 -2.75,-2.5; P$AC5 -2,-2.75; P$AC9 -1,-2.75; P$AC11 -0.5,-2.75; P$AC13 0,-2.75; P$AC15 0.5,-2.75; P$AC17 1,-2.75; P$AC19 1.5,-2.75; P$AC21 2,-2.75; P$AC24 3.25,-2.75; P$AD2 -2.75,-3.25; P$AD4 -2.25,-3.25; P$AD6 -1.75,-3.25; P$AD8 -1.25,-3.25; P$AD10 -0.75,-3.25; P$AD12 -0.25,-3.25; P$AD14 0.25,-3.25; P$AD16 0.75,-3.25; P$AD18 1.25,-3.25; P$AD20 1.75,-3.25; P$AD22 2.25,-3.25; P$AD23 2.75,-3.25; P$B1 -3.25,2.75; P$B3 -2.5,2.75; P$B5 -2,2.75; P$B7 -1.5,2.75; P$B9 -1,2.75; P$B11 -0.5,2.75; P$B13 0,2.75; P$B15 0.5,2.75; P$B17 1,2.75; P$B19 1.5,2.75; P$B24 3.25,2.75; P$C1 -3.25,2.25; P$D2 -2.75,2; P$D23 2.75,2; P$E24 3.25,1.75; P$F2 -2.75,1.5; P$F23 2.75,1.5; P$G1 -3.25,1.25; P$H2 -2.75,1; P$H23 2.75,1; P$J1 -3.25,0.75; P$J24 3.25,0.75; P$K2 -2.75,0.5; P$L1 -3.25,0.25; P$L24 3.25,0.25; P$M2 -2.75,0; P$N1 -3.25,-0.25; P$N24 3.25,-0.25; P$P2 -2.75,-0.5; P$P23 2.75,-0.5; P$R1 -3.25,-0.75; P$R24 3.25,-0.75; P$T2 -2.75,-1; P$T23 2.75,-1; P$U1 -3.25,-1.25; P$U24 3.25,-1.25; P$V23 2.75,-1.5; P$W1 -3.25,-1.75; P$W24 3.25,-1.75; P$Y2 -2.75,-2; P$Y23 2.75,-2
ESP32_C6_LIBRARY_SON50P200X200X80-9N = smd 0.76 x 0.27: 1 -0.985,0.75; 2 -0.985,0.25; 3 -0.985,-0.25; 4 -0.985,-0.75; 5 0.985,-0.75; 6 0.985,-0.25; 7 0.985,0.25; 8 0.985,0.75 | smd 0.9 x 1.3: 9 0,0
NORDIC_NRF_BT-XTAL_2016_N = smd 0.95 x 0.85: 1 -0.725,-0.575; 2 0.725,-0.575; 3 0.725,0.575; 4 -0.725,0.575
NORDIC_NRF_1_XTAL_3215_N = smd 1 x 1.8: 1 -1.25,0; 2 1.25,0

### Placement (x,y rotation side)
ANT1  49.87,29.74 0 top
C1  47.18,26.3 0 top
C1-EP-DR  28.13,26.3 0 top
C2  47.18,25.03 0 top
C2-EP-DR1  28.13,21.22 0 top
C3  43.37,27.57 0 top
C4  44.95,27.2 0 top
C5  33.21,18.68 0 top
C6  40.83,31.09 0 top
C7  38.29,31.38 0 top
C8  38.29,30.11 0 top
C9  39.56,30.11 0 top
C10  49.72,27.57 0 top
C11  50.03,26.3 0 top
C12  49.72,25.03 0 top
C13  49.72,23.76 0 top
C14  43.37,22.49 0 top
C15  43.37,21.22 0 top
C16  43.37,19.95 0 top
C17  49.72,18.68 0 top
C18  49.72,17.41 0 top
C19  15.43,8.52 0 top
C20  40.83,30.11 0 top
C21  39.56,31.38 0 top
C22  47.18,27.57 0 top
C23  10.35,7.25 0 top
C24  5.27,25.71 0 top
C25  11.62,7.25 0 top
C27  19.24,31.38 0 top
C29  44.19,1.72 0 top
C30  30.67,1.21 0 top
C31  16.7,1.21 0 top
C32  19.24,28.84 0 top
C33  11.62,8.52 0 top
C34  35.75,3.44 0 top
C37  2.77,31.68 0 top
C38  9.08,30.11 0 top
C39  15.86,5.78 0 top
C42  38.29,33.79 0 top
C43  38.29,32.65 0 top
D1  23.05,13.6 0 top
D6  23.05,17.41 0 top
D7  23.05,9.79 0 top
D8  34.48,32.66 0 top
EPD_C3  14.16,22.49 0 top
EPD_C4  14.16,21.22 0 top
EPD_C5  14.16,19.95 0 top
EPD_C6  14.16,18.68 0 top
EPD_C7  14.16,17.41 0 top
EPD_C8  14.16,16.14 0 top
EPD_C9  14.16,14.87 0 top
EPD_C10  14.16,13.6 0 top
EPD_C11  14.16,12.33 0 top
EPD_C12  14.16,11.06 0 top
IC1  5.27,31.38 0 top
IC2  15.43,28.84 0 top
IC3  44.64,32.65 0 top
IC9  20.51,4.9 0 top
J2  31.94,12.02 0 top
J3  9.72,17.5 270 top
J5  25.59,33.33 180 top
L1  44.64,28.71 0 top
L2  49.72,22.49 0 top
L3  49.72,21.22 0 top
L5  23.05,23.76 0 top
L7  24.32,5.98 0 top
Q3  29.4,23.76 0 top
Q4  10.35,32.36 0 top
R1  33.21,3.44 0 top
R1_EP_DR1  25.59,19.95 0 top
R1_USB1  33.21,26.3 0 top
R2  40.83,5.98 90 top
R2_EP_DR1  31.94,23.39 172.7 top
R2_USB1  16.7,3.44 0 top
R3  42.1,30.11 0 top
R4  16.7,26.3 0 top
R6  17.97,26.3 0 top
R9  10.35,26.45 0 top
R10  44.64,4.71 0 top
R17  48.45,32.65 0 top
R18  29.4,3.44 0 top
R_PWR_EPD1  14.16,26.3 0 top
R_TYPE_SEL1  26.86,19.95 0 top
SJ1  29.4,18.68 0 top
SW_DN1  39.56,2.54 180 top
SW_ENT1  25.54,2.54 180 top
SW_UP1  12,2.66 180 top
TP1  5.39,4.99 0 top
TP2  7.81,3.44 0 top
TP_3.3V  5.73,8.51 0 top
TP_BAT_GND1  2.41,5.52 0 top
TP_GND  2.09,8.51 0 top
TP_ON1  2.73,27.76 0 top
TP_OP1  5.81,27.57 0 top
TP_RESET  41.85,13.35 0 top
TP_SCL  46.45,13.6 0 top
TP_SDA  42.1,9.79 0 top
TP_SWDCLK  47.18,9.79 0 top
TP_SWDIO  47.18,5.98 0 top
TP_SWO  50.99,13.6 0 top
TP_VBAT1  51.53,9.79 0 top
U1  38.29,25.03 0 top
U2  16.7,33.02 0 top
X1  44.64,25.03 0 top
X2  43.37,17.41 0 top

### Tracks (layer width: path | path; a pad name or v marks a point on that pad's centre or on a via)
3V3/1.7D  (via drill 0.35)
  Top 0.152: 35.95,3.44 35.95,3.13 35.8,2.98 33.67,2.98 | 33.67,2.98 33.36,2.98 33.21,3.13 R1.2 | v41.9,4.35 44.64,4.35 R10.2 | 35.95,3.44 v36.56,4.05 | 35.95,3.44 C34.2 | 15.38,27.67 15.38,27.06 14.47,26.15 14.16,26.15 R_PWR_EPD1.2 | 15.38,27.67 15.38,27.98 | 15.38,27.98 15.38,28.28 IC2.C2 | v17.97,25.23 R6.2 | v17.97,27.98 17.21,27.98 16.9,27.67 15.38,27.67 | 15.38,27.98 14.47,27.98 11.42,31.02 11.42,31.33 Q4.2 | 33.67,2.98 33.67,4.35 31.53,6.49 27.11,6.49 26.35,7.25 26.35,10.91 25.59,11.67 v24.68,11.67
  Bottom 0.152: v41.9,4.35 36.87,4.35 v36.56,4.05 | v17.97,27.98 v17.97,25.23 17.97,22.18 19.19,20.97 19.65,20.97 20.26,20.36 20.26,17.99 21.27,16.98 21.27,16.73 21.09,16.55 20.72,16.55 20.36,16.19 20.36,15.69 20.72,15.33 21.01,15.33 v24.68,11.67
3V3/2.4A  (via drill 0.35)  (1 unrouted)
  Top 0.152: C12.1 49.52,25.08 49.52,25.39 49.67,25.54 50.28,25.54 50.74,25.08 50.74,20.81 50.58,20.66 48.15,20.66 47.08,21.73 43.57,21.73 43.12,22.18 C14.1 v42.35,22.49 | 35.04,23.25 35.34,23.25 35.5,23.1 U1.P$Y2 | 38.54,21.73 39.76,20.51 40.68,20.51 40.98,20.81 40.98,21.12 | 40.98,21.12 40.98,21.73 U1.P$AD23 | 35.04,22.64 35.04,21.73 35.34,21.42 38.24,21.42 38.54,21.73 | 35.04,22.64 35.04,23.25 | 35.04,23.25 U1.P$W1 | 38.54,21.73 U1.P$AD14 | 47.23,31.79 48.45,33.01 R17.1 | 47.23,31.79 46.16,30.72 | 46.16,30.72 45.4,29.96 44.79,29.96 44.49,30.26 44.49,30.87 44.79,31.18 44.79,31.79 IC3.3 | 47.23,31.79 45.71,33.31 45.4,33.31 IC3.7 | IC3.10 43.88,33.31 42.05,33.31 41.44,32.7 41.44,31.48 41.59,31.33 41.59,30.87 41.29,30.57 40.83,30.57 40.68,30.72 40.68,31.02 C6.1 40.53,31.18 v40.53,31.94 | 36.72,29.96 36.87,30.11 37.78,30.11 | 36.72,29.96 35.04,28.28 35.04,27.82 U1.P$B1 | C8.1 37.78,30.11 | 37.78,30.11 38.54,29.35 39.46,29.35 40.53,28.28 U1.P$A22 | v37.33,31.48 37.93,31.48 C7.1 | 36.72,29.96 v36.87,29.96 | v46.01,30.87 46.16,30.72 | v34.89,22.64 35.04,22.64 | 40.98,21.12 v41.29,21.12 | C33.1 11.42,8.47 11.42,7.25 C25.1 11.26,7.25 9.13,5.12 5.47,5.12 TP1.TP | C19.1 15.07,8.62 12.48,8.62 12.03,9.08 11.72,9.08 11.26,8.62 C33.1 | 20.87,4.05 20.56,4.05 IC9.E2 | v23.15,4.05 20.87,4.05 | v28.64,4.05 29.1,4.05 29.4,3.74 R18.1 | 20.87,4.05 IC9.E3 | v7.61,8.47 5.78,8.47 TP_3.3V.TP | v10.66,8.47 11.26,8.47 C33.1
  Bottom 0.152: v40.53,31.94 37.78,31.94 v37.33,31.48 37.33,30.41 v36.87,29.96 36.87,29.2 37.33,28.74 | v46.01,30.87 46.01,32.24 44.95,33.31 44.34,33.31 40.98,29.96 39.15,29.96 37.93,28.74 37.33,28.74 | v34.89,22.64 34.89,26.3 37.33,28.74 | v42.35,22.49 42.35,22.18 v41.29,21.12 40.68,21.73 40.07,21.73 39.46,21.12 39.46,13.35 41.59,11.21 41.59,6.79 39.46,4.66 35.5,4.66 35.19,4.96 33.67,4.96 31.08,2.37 30.31,2.37 v28.64,4.05 v23.15,4.05 22.69,4.51 14.77,4.51 10.81,8.47 v10.66,8.47 v7.61,8.47
22UF
  Top 0.152: C25.2 11.87,8.47 C33.2
DN
  Top 0.152: 25.44,29.35 25.44,28.74 J5.A7 | 25.44,29.35 28.18,32.09 31.38,32.09 32.75,33.46 33.21,33.46 D8.1 | 25.44,29.35 23.61,31.18 21.63,31.18 20.41,29.96 20.41,28.28 21.93,26.76 25.13,26.76 26.35,27.98 26.35,28.59 J5.B7
DP
  Top 0.152: J5.B6 24.83,28.59 24.83,27.98 25.13,27.67 25.59,27.67 25.74,27.82 25.74,28.59 J5.A6 25.9,28.74 25.9,29.35 28.18,31.63 33.21,31.63 D8.3
EPD_3V3  (via drill 0.35)
  Top 0.152: 11.26,16.24 11.26,15.78 J3.16 | 15.84,19.9 17.36,19.9 20.48,16.78 22.17,16.78 24.52,19.14 24.52,22.95 L5.2 25.44,23.86 25.44,24.93 26.81,26.3 C1-EP-DR.1 | 15.84,19.9 14.47,19.9 EPD_C5.2 | v12.18,16.24 11.26,16.24 | 15.84,19.9 v15.84,18.22 | 11.26,16.24 J3.15 | v7.61,32.85 8.06,33.31 10.35,33.31 Q4.3
  Bottom 0.152: 14.62,18.68 v12.18,16.24 | 14.62,18.68 15.38,18.68 v15.84,18.22 | v7.61,32.85 6.54,32.85 3.19,29.5 3.19,28.89 6.39,25.69 7.36,25.69 9.61,23.45 9.61,23.4 12.5,20.51 13.4,20.51 14.62,19.29 14.62,18.68
GDR  (via drill 0.35)
  Top 0.152: v31.38,24.93 31.38,24.78 31.84,24.32 31.84,23.71 R2_EP_DR1.2 | v29.86,24.62 28.64,24.62 28.49,24.47 Q3.1 28.33,24.47 v27.27,24.47 | v12.94,23.86 11.87,22.8 11.26,22.8 J3.2 | v19.65,20.05 22.09,20.05 v23.15,21.12
  Bottom 0.152: v31.38,24.93 30.16,24.93 v29.86,24.62 | v12.94,23.86 13.86,23.86 17.67,20.05 v19.65,20.05 | v23.15,21.12 23.91,21.12 v27.27,24.47
GND  (via drill 0.35)  (7 unrouted)
  Top 0.152: 31.99,20.97 31.99,20.66 33.36,19.29 33.36,18.68 C5.2 | 31.99,20.97 31.99,23.1 R2_EP_DR1.1 31.84,23.1 31.38,23.56 31.38,24.01 29.1,26.3 C1-EP-DR.2 | 29.55,20.2 30.47,20.2 31.08,19.59 31.08,17.77 30.92,17.61 29.4,17.61 28.64,18.38 SJ1.1 | 29.55,20.2 26.96,20.2 R_TYPE_SEL1.1 | 40.22,26.76 40.37,26.6 40.98,26.6 U1.P$F23 | 36.56,26.91 36.72,27.06 36.72,27.82 U1.P$B7 | 36.56,24.32 36.56,23.25 U1.P$87 | 36.56,24.32 U1.P$83 | 36.56,24.32 U1.P$74 | 37.17,26.3 36.56,25.69 U1.P$79 | 37.78,24.32 37.78,23.25 | 37.78,24.32 U1.P$84 | 37.78,24.32 U1.P$74 | U1.P$80 37.78,25.69 U1.P$74 | 37.78,23.25 38.85,23.25 U1.P$89 39,23.25 40.07,23.25 U1.P$90 | 37.78,23.25 U1.P$88 | U1.P$74 U1.P$85 39,24.47 40.07,24.47 U1.P$86 | U1.P$81 39,25.69 U1.P$74 | 36.56,26.91 U1.P$75 | 36.56,26.91 U1.P$74 | 37.17,26.3 37.63,26.76 U1.P$76 | 37.17,26.3 U1.P$74 | 39.61,26.15 40.07,25.69 U1.P$82 | 39.61,26.15 39,26.76 U1.P$77 | 39.61,26.15 U1.P$74 | v29.55,21.27 29.55,20.2 | v32.14,20.97 31.99,20.97 | 44.03,23.1 45.25,24.32 X1.2 | 44.03,23.1 43.73,22.8 43.73,22.49 C14.2 | 47.54,26.3 47.54,25.08 C2.2 47.38,24.93 47.38,24.47 47.23,24.32 | 47.54,26.3 47.54,27.06 | 47.54,27.06 47.54,27.52 C22.2 47.54,27.67 48.76,27.67 49.21,28.13 49.67,28.13 49.97,27.82 49.97,27.67 C10.2 49.97,27.52 49.97,26.91 50.28,26.6 C11.2 50.43,26.3 51.35,25.39 51.35,19.29 50.28,18.22 49.67,18.22 49.52,18.38 49.52,18.68 C17.1 | 47.54,26.3 C1.2 | 43.73,26.76 43.73,25.84 43.88,25.69 X1.4 | 43.73,26.76 43.73,27.52 C3.2 | 43.73,26.76 44.95,26.76 45.1,26.91 45.1,27.06 C4.2 45.25,27.06 47.54,27.06 | 44.03,23.1 44.64,22.49 45.4,22.49 47.23,24.32 | C12.2 49.97,24.93 49.97,23.86 C13.2 49.97,23.71 49.97,23.56 49.67,23.25 48.91,23.25 v48.76,23.4
  Top 0.152: C15.2 43.73,21.12 43.73,20.05 C16.2 43.73,19.9 v45.86,19.9 | IC3.8 44.79,33.46 44.49,33.46 IC3.9 44.49,33.31 44.49,32.85 v44.64,32.7 | v47.99,18.53 49.06,17.46 49.36,17.46 C18.1 | v47.38,24.17 47.23,24.32 | 40.22,26.76 U1.P$74 | 40.22,26.76 U1.P$78 | R1_USB1.1 33.21,26.6 32.45,26.6 30.01,29.04 J5.SH3 30.01,29.2 30.01,31.02 30.31,31.33 32.3,31.33 32.45,31.18 34.89,31.18 | C42.2 38.54,33.77 38.54,32.7 C43.2 38.54,32.55 38.54,32.09 | 38.54,32.09 38.54,31.48 C7.2 | R3.1 42.05,30.26 41.29,30.26 41.14,30.11 C20.2 40.98,30.11 40.98,29.8 40.83,29.65 40.37,29.65 | 39.61,29.65 39,29.65 C8.2 | 39.61,29.65 39.76,29.8 39.76,30.11 C9.2 39.92,30.11 39.92,31.33 C21.2 39.92,31.48 39.92,32.09 | 39.92,32.09 39.92,32.24 40.22,32.55 40.83,32.55 41.14,32.24 41.14,31.18 C6.2 | 39.61,29.65 40.37,29.65 | 39.92,32.09 38.54,32.09 | 34.89,31.18 34.89,31.33 33.67,32.55 33.36,32.55 D8.2 | 34.89,31.18 36.56,31.18 36.72,31.33 36.72,31.79 37.02,32.09 38.54,32.09 | 16.45,32.55 16.6,32.7 16.6,32.85 | 16.45,32.55 16.29,32.4 15.84,32.4 U2.4 | 16.6,32.85 16.6,33.01 U2.9 | 16.6,32.85 17.67,32.85 U2.6 | 16.6,32.85 U2.9 | 14.47,32.09 14.47,32.85 15.38,33.77 15.68,33.77 U2.1 15.84,33.77 16.14,33.77 16.6,33.31 16.6,33.16 U2.9 | 14.47,32.09 14.47,29.2 14.77,28.89 14.92,28.89 IC2.B1 | IC2.B3 15.99,28.89 19.04,28.89 C32.1 19.04,28.74 19.04,28.59 19.19,28.43 19.65,28.43 19.95,28.74 19.95,31.63 19.49,32.09 | 19.04,31.63 19.04,31.48 C27.1 | 19.49,32.09 20.71,33.31 21.17,33.31 J5.SH2 21.32,33.31 29.86,33.31 J5.SH1 | 19.49,32.09 19.04,31.63 | 16.45,32.55 17.36,31.63 19.04,31.63 | 16.45,32.55 U2.9 | v14.62,24.32 14.01,23.71 14.01,22.49 EPD_C3.1
  Top 0.152: v15.84,22.8 21.17,17.46 D6.1 | 40.37,29.65 v40.37,29.35 | 29.25,2.22 28.03,3.44 26.96,3.44 SW_ENT1.1 26.81,3.59 26.81,5.73 v26.5,6.03 | 29.25,2.22 30.16,1.31 30.47,1.31 C30.1 | 36.72,4.66 40.22,4.66 40.83,4.05 40.83,3.59 SW_DN1.1 40.98,3.44 41.59,3.44 43.27,1.76 44.03,1.76 C29.1 | 36.72,4.66 36.26,4.66 35.5,3.9 35.5,3.44 C34.1 | 29.25,2.22 30.16,3.13 30.16,3.29 v31.99,5.12 | 36.72,4.66 v36.72,5.27 | 4.86,25.99 5.02,25.84 C24.1 | 4.86,25.99 4.41,26.45 4.41,29.5 2.58,31.33 2.58,31.63 C37.1 | 7.15,30.72 7.45,30.72 8.52,29.65 9.13,29.65 | 7.15,30.72 5.47,30.72 IC1.D2 | 9.13,29.65 9.28,29.8 9.28,30.11 C38.2 | 10.35,26.91 10.35,28.43 9.13,29.65 | 10.35,26.91 R9.1 | 9.59,24.17 8.67,24.17 J3.MP1 | 10.2,24.78 10.81,25.39 10.81,26.45 10.35,26.91 | 10.2,24.78 9.59,24.17 | 4.86,25.99 5.17,26.3 8.67,26.3 10.2,24.78 | 14.01,19.29 14.01,19.9 EPD_C5.1 | 14.01,19.29 14.01,18.68 | EPD_C11.1 14.01,12.43 14.01,13.5 EPD_C10.1 14.01,13.65 14.01,14.87 | 14.01,14.87 14.01,16.09 EPD_C8.1 14.01,16.24 14.01,17.31 EPD_C7.1 14.01,17.46 14.01,18.68 | 14.01,14.87 EPD_C9.1 | 14.01,18.68 EPD_C6.1 | 11.87,20.05 11.57,19.75 11.26,19.75 J3.8 11.11,19.75 10.81,19.75 | 11.87,20.05 12.94,21.12 13.86,21.12 EPD_C4.1 | 10.81,15.33 11.11,15.33 J3.17 | 10.81,15.33 10.66,15.48 10.66,19.59 10.81,19.75 | 14.01,19.29 12.64,19.29 11.87,20.05 | 20.1,5.27 20.1,4.96 IC9.C1 | 16.9,5.27 16.6,5.27 16.45,5.42 | 16.9,5.27 18.88,5.27 | 18.88,5.27 20.1,5.27 | 16.45,5.42 16.14,5.73 C39.2 | 20.1,5.27 IC9.B1 | 16.45,2.98 16.45,1.31 C31.1 | 16.45,2.98 16.6,3.13 R2_USB1.2 | 16.45,2.98 14.62,2.98 14.31,3.29 13.86,3.29 13.55,3.59 SW_UP1.1 13.4,3.74 14.16,4.51 15.53,4.51 16.45,5.42
  Top 0.152: 9.74,11.06 EPD_C12.1 14.01,11.06 14.01,10.75 15.68,9.08 15.68,8.62 C19.2 15.68,8.47 v15.68,7.1 | 9.74,11.06 8.67,11.06 J3.MP2 8.52,10.91 8.52,8.47 7.3,7.25 5.78,7.25 4.1,5.57 2.43,5.57 TP_BAT_GND1.TP | v16.9,5.88 16.9,5.27 | 10.81,15.33 9.74,14.26 9.74,11.06 | 9.59,24.17 9.59,20.97 10.81,19.75 | 18.88,5.27 v18.88,6.03 | 14.47,32.09 8.52,32.09 7.15,30.72
  Bottom 0.152: v29.55,21.27 30.16,21.27 30.47,20.97 v32.14,20.97 34.28,20.97 36.41,23.1 U1.P$87 | 47.99,18.68 47.99,18.83 48.91,19.75 48.91,23.4 48.76,23.56 | 47.69,24.62 43.73,28.59 43.73,30.41 43.42,30.72 | 47.69,24.62 48.76,23.56 | 43.42,30.72 42.2,30.72 40.68,29.2 | 40.68,29.2 40.22,28.74 40.22,26.91 U1.P$78 | v44.64,32.7 44.64,31.94 43.42,30.72 | v45.86,19.9 47.08,18.68 47.99,18.68 | 47.99,18.68 v47.99,18.53 | 48.76,23.56 v48.76,23.4 | v47.38,24.17 47.69,24.47 47.69,24.62 | J5.SH3 30.01,29.2 31.23,30.41 31.23,32.09 30.01,33.31 J5.SH1 | v15.84,22.8 15.84,23.1 v14.62,24.32 14.62,25.39 17.36,28.13 17.36,28.28 18.12,29.04 21.17,29.04 J5.SH4 21.17,29.2 21.17,33.31 J5.SH2 | 40.68,29.2 40.53,29.2 v40.37,29.35 | v31.99,5.12 33.36,5.12 33.52,5.27 v36.72,5.27 | v15.68,7.1 v16.9,5.88 | v26.5,6.03 v18.88,6.03
IMU_INT1  (via drill 0.35)
  Top 0.152: v40.98,19.59 40.37,20.2 36.11,20.2 34.28,22.03 34.28,24.01 U1.P$N1 | v46.01,29.65 v47.23,29.65 | v45.1,30.57 45.1,30.87 45.86,31.63 45.86,32.09 45.55,32.4 IC3.5
  Bottom 0.152: v40.98,19.59 41.44,19.59 42.2,18.83 43.57,18.83 48.6,13.8 48.6,13.35 48.91,13.04 49.52,13.04 50.74,14.26 50.74,26.15 v47.23,29.65 | v45.1,30.57 v46.01,29.65
IMU_INT2  (1 unrouted)
LX1
  Top 0.152: 20.87,5.27 20.56,5.27 IC9.B2 | 20.87,5.27 22.54,5.27 23.15,5.88 L7.1 | 20.87,5.27 IC9.B3
LX3
  Top 0.152: IC9.D2 20.56,4.51 20.87,4.51 IC9.D3
N$1
  Top 0.152: IC1.D1 5.02,30.72 6.54,29.2 7.3,29.2 9.89,26.6 9.89,26.45 10.2,26.15 10.35,26.15 R9.2
N$2  (via drill 0.35)
  Top 0.152: v17.51,3.9 18.12,4.51 IC9.D1 | v13.09,19.9 13.86,20.66 14.62,20.66 15.23,21.27 15.23,25.23 16.6,26.6 R4.1
  Bottom 0.152: v17.51,3.9 15.38,3.9 14.77,3.29 11.42,3.29 6.69,8.01 6.69,8.93 7.15,9.38 7.45,9.38 9.74,11.67 9.74,16.55 v13.09,19.9
N$3  (via drill 0.35)
  Top 0.152: v21.02,2.98 20.1,3.9 20.1,4.05 IC9.E1 | v34.89,4.35 36.41,5.88 40.53,5.88 R2.1
  Bottom 0.152: v21.02,2.98 29.25,2.98 30.16,2.07 32.6,2.07 v34.89,4.35
N$4  (1 unrouted)
N$5  (via drill 0.35)
  Top 0.152: v42.81,24.78 41.59,24.78 U1.P$N24 | v47.38,19.29 48.15,19.29 49.52,17.92 50.28,17.92 50.43,17.77 50.43,17.16 48.15,14.87 v36.87,14.87 | v34.43,28.43 36.56,30.57 38.85,30.57 C9.1
  Bottom 0.152: v42.81,24.78 44.34,24.78 46.16,22.95 46.16,20.51 v47.38,19.29 | v36.87,14.87 35.95,14.87 30.16,20.66 28.94,20.66 27.88,21.73 27.88,23.56 32.75,28.43 v34.43,28.43
N$6  (via drill 0.35)
  Top 0.152: 42.2,26.15 42.81,26.15 43.12,26.45 43.12,27.52 C3.1 | 42.2,26.15 41.44,26.15 41.29,25.99 41.14,25.99 U1.P$H23 | v42.66,28.89 42.81,28.74 44.03,28.74 L1.1 | 42.2,26.15 v42.2,25.84
  Bottom 0.152: v42.66,28.89 41.74,27.98 41.74,26.3 v42.2,25.84
N$7
  Top 0.152: C4.1 44.79,27.21 44.79,27.52 44.95,27.67 45.55,27.67 45.71,27.52 46.93,27.52 C22.1 46.93,27.67 46.93,28.13 46.77,28.28 | 46.77,28.28 46.32,28.74 45.25,28.74 L1.2 | 46.77,28.28 48.3,29.8 ANT1.1
N$8  (via drill 0.35)
  Top 0.152: v46.01,28.13 43.73,28.13 43.57,28.28 42.05,28.28 41.59,27.82 U1.P$B24 | v42.35,23.4 42.96,23.4 43.88,24.32 X1.1 44.03,24.47 44.64,25.08 44.64,26.15 44.79,26.3 C1.1
  Bottom 0.152: v46.01,28.13 50.43,23.71 50.43,19.14 48.6,17.31 46.01,17.31 42.96,20.36 42.96,22.8 v42.35,23.4
N$9  (via drill 0.35)
  Top 0.152: v41.59,28.74 41.14,28.28 U1.P$A23 | v45.1,23.1 45.71,23.71 45.86,23.71 46.93,24.78 46.93,24.93 C2.1 46.93,25.08 46.47,25.54 45.4,25.54 X1.3
  Bottom 0.152: v41.59,28.74 41.59,28.28 41.44,28.13 41.44,25.23 43.57,23.1 v45.1,23.1
N$10  (via drill 0.35)
  Top 0.152: v42.35,27.67 42.05,27.37 41.44,27.37 41.14,27.06 U1.P$D23 | v48.3,20.05 50.43,20.05 51.04,20.66 51.04,25.23 50.43,25.84 49.97,25.84 49.82,25.99 49.82,26.3 C11.1
  Bottom 0.152: v42.35,27.67 42.96,27.67 48.45,22.18 48.45,20.2 v48.3,20.05
N$11  (via drill 0.35)
  Top 0.152: v37.63,29.35 37.93,29.04 38.85,29.04 39.46,28.43 39.46,28.28 U1.P$A18 | v48.91,24.32 49.36,23.86 C13.1
  Bottom 0.152: v37.63,29.35 38.09,29.35 40.07,31.33 41.9,31.33 44.18,33.62 45.1,33.62 46.62,32.09 46.62,29.35 46.01,28.74 45.71,28.74 45.4,28.43 45.4,27.82 v48.91,24.32
N$12
  Top 0.152: L3.2 50.28,21.27 50.28,22.49 L2.2
N$13  (1 unrouted)
N$14  (via drill 0.35)
  Top 0.152: v42.51,26.76 41.59,26.76 U1.P$E24 | 48.15,21.88 48.6,21.88 49.21,21.27 L3.1 | 48.15,21.88 48.15,24.47 49.36,25.69 49.36,27.52 C10.1 | 48.15,21.88 v47.84,21.88 | v36.11,28.43 36.26,28.28 36.26,27.82 U1.P$B5 | v33.67,22.18 36.26,19.59 v40.07,19.59 | 43.27,19.29 43.27,19.59 43.12,19.75 43.12,19.9 C16.1 43.12,20.05 43.12,21.12 C15.1 | 43.27,19.29 v43.27,18.22 | v46.77,20.81 46.77,19.9 46.16,19.29 43.27,19.29
  Bottom 0.152: v42.51,26.76 42.96,26.76 v47.84,21.88 v46.77,20.81 | v36.11,28.43 36.11,27.98 33.67,25.54 v33.67,22.18 | v40.07,19.59 41.44,18.22 v43.27,18.22
N$15  (via drill 0.35)
  Top 0.152: v34.12,27.21 35.04,27.21 U1.P$C1 | v31.38,22.34 31.38,20.81 32.91,19.29 32.91,18.68 C5.1
  Bottom 0.152: v34.12,27.21 34.12,26.45 32.91,25.23 32.91,23.86 v31.38,22.34
N$16  (via drill 0.35)  (1 unrouted)
  Top 0.152: v49.82,19.44 49.97,19.29 C17.2 | v46.32,17.92 45.86,17.92 45.1,18.68 44.03,18.68 43.88,18.53 43.88,17.92 43.42,17.46 42.2,17.46 X2.1
  Bottom 0.152: v49.82,19.44 48.3,17.92 v46.32,17.92
N$17  (via drill 0.35)
  Top 0.152: v32.3,24.78 32.6,24.78 34.58,26.76 35.04,26.76 35.19,26.6 35.5,26.6 U1.P$F2 | v30.77,21.58 30.77,20.97 32.45,19.29 32.45,18.38 33.67,17.16 39,17.16 40.98,15.17 42.35,15.17 44.49,17.31 X2.2 44.64,17.31 45.1,16.85 49.67,16.85 49.97,17.16 49.97,17.31 C18.2
  Bottom 0.152: v32.3,24.78 32.3,24.17 30.77,22.64 v30.77,21.58
N$19
  Top 0.152: R3.2 42.2,29.96 42.35,29.96 42.51,30.11 42.51,30.41 43.88,31.79 IC3.1
N$30  (via drill 0.35)
  Top 0.152: 28.49,21.73 28.49,21.27 C2-EP-DR1.2 | v29.55,23.1 30.31,23.86 Q3.3 | 28.49,21.73 v26.96,21.73 | D7.2 24.68,9.84 24.68,10.75 24.07,11.37 24.07,11.97 24.98,12.89 25.44,12.89 25.6,13.05 25.6,17.62 25.74,17.76 v25.74,18.83 | 28.49,21.73 v28.49,22.03 | v21.78,20.66 20.87,21.58 20.87,23.71 L5.1
  Bottom 0.152: v29.55,23.1 v28.49,22.03 | 25.74,19.59 25.74,20.51 v26.96,21.73 | 25.74,19.59 v25.74,18.83 | v21.78,20.66 22.85,19.59 25.74,19.59
N$32
  Top 0.152: C2-EP-DR1.1 27.88,21.12 26.2,21.12 25.74,20.66 25.29,20.66 24.83,20.2 24.83,17.46 D6.2 24.68,17.31 21.32,13.96 21.32,13.65 D1.1
N$35
  Top 0.152: R1_EP_DR1.1 25.59,20.2 25.74,20.2 26.2,19.75 26.81,19.75 R_TYPE_SEL1.2 26.96,19.75 29.4,19.75 30.16,18.98 SJ1.2
N$36
  Top 0.152: C32.2 19.49,28.89 19.49,29.04 18.43,30.11 16.14,30.11 15.38,29.35 IC2.A2
N$37
  Top 0.152: EPD_C4.2 14.31,21.27 14.31,21.58 14.16,21.73 12.18,21.73 11.72,21.27 11.26,21.27 J3.5
N$38
  Top 0.152: EPD_C3.2 14.31,22.49 14.31,22.18 14.16,22.03 11.87,22.03 11.57,21.73 11.26,21.73 J3.4
N$39  (via drill 0.35)
  Top 0.152: v14.92,18.07 14.92,18.22 14.47,18.68 EPD_C6.2 | v12.18,15.33 11.72,14.87 11.26,14.87 J3.18
  Bottom 0.152: v12.18,15.33 v14.92,18.07
N$40  (via drill 0.35)
  Top 0.152: v15.07,16.7 14.47,17.31 EPD_C7.2 | v12.94,14.56 12.03,14.56 11.72,14.26 11.26,14.26 J3.19
  Bottom 0.152: v12.94,14.56 v15.07,16.7
N$41  (via drill 0.35)
  Top 0.152: v14.92,15.48 14.92,15.63 14.47,16.09 EPD_C8.2 | v12.18,13.8 11.26,13.8 J3.20
  Bottom 0.152: v14.92,15.48 13.4,13.96 12.33,13.96 v12.18,13.8
N$42  (via drill 0.35)
  Top 0.152: v15.07,12.89 14.47,13.5 EPD_C10.2 | v13.09,12.89 11.72,12.89 11.57,12.74 11.26,12.74 J3.22
  Bottom 0.152: v13.09,12.89 v15.07,12.89
N$43
  Top 0.152: EPD_C12.2 14.31,11.06 14.31,11.37 14.16,11.52 11.42,11.52 11.26,11.67 J3.24
N$44
  Top 0.152: R1_USB1.2 33.21,26.15 29.71,26.15 28.18,27.67 27.11,27.67 26.81,27.98 26.81,28.59 J5.A5
N$45  (via drill 0.35)
  Top 0.152: v14.47,3.9 14.62,3.74 16.6,3.74 R2_USB1.1 | v23.3,27.37 23.76,27.82 23.76,28.59 J5.B5
  Bottom 0.152: v14.47,3.9 11.26,3.9 7,8.16 7,8.77 7.3,9.08 14.62,9.08 18.28,5.42 28.94,5.42 29.55,4.81 30.16,4.81 30.47,5.12 30.47,6.03 30.11,6.39 29.53,6.39 26.35,9.57 26.35,15.17 21.78,19.75 21.32,19.75 19.8,21.27 19.34,21.27 19.04,21.58 19.04,25.39 21.02,27.37 v23.3,27.37
OUT+  (via drill 0.35)
  Top 0.152: v16.6,29.5 16.45,29.35 15.99,29.35 IC2.A3 | v7,28.59 5.93,27.52 TP_OP1.TP
  Bottom 0.152: v16.6,29.5 15.99,29.5 11.04,24.55 v7,28.59
OUT-  (via drill 0.35)
  Top 0.152: v16.6,28.28 15.99,28.28 IC2.C3 | v3.8,29.2 3.8,28.89 2.73,27.82 TP_ON1.TP
  Bottom 0.152: v3.8,29.2 4.56,29.96 5.32,29.96 5.63,29.65 5.63,29.04 6.6,29.04 6.75,29.19 7.25,29.19 7.85,28.59 14.65,28.59 16.17,30.11 16.85,30.11 17.21,29.75 17.21,29.25 16.6,28.64 v16.6,28.28
P0.13/1.5D  (via drill 0.35)
  Top 0.152: 31.53,2.22 32.91,3.59 33.21,3.59 R1.1 | 31.53,2.22 30.92,1.61 30.92,1.31 C30.2 | v15.07,5.12 11.72,5.12 10.66,4.05 10.66,3.74 SW_UP1.2 | 31.53,2.22 v30.77,2.98
  Bottom 0.152: v15.07,5.12 28.64,5.12 v30.77,2.98
P0.14/1.5D  (via drill 0.35)
  Top 0.152: C31.2 16.9,1.31 20.87,1.31 23,3.44 24.07,3.44 SW_ENT1.2 24.22,3.59 24.22,6.95 25.74,8.47 v25.74,10.6 | v19.65,25.08 18.28,26.45 17.97,26.45 R6.1 | v23.15,20.2 23.15,18.68 v22.54,18.07
  Bottom 0.152: v19.65,25.08 19.65,23.71 v23.15,20.2 | v25.74,10.6 25.74,11.52 22.84,14.42 22.84,16.19 22.54,16.49 v22.54,18.07
P1.01/1.6C
  Top 0.152: R_PWR_EPD1.1 14.16,26.6 9.44,31.33 Q4.1
P1.02/1.6C  (via drill 0.35)  (1 unrouted)
  Top 0.152: v43.42,4.96 44.64,4.96 R10.1 | v35.5,2.37 36.41,2.37 37.48,3.44 38.09,3.44 SW_DN1.2
  Bottom 0.152: v43.42,4.96 41.59,3.13 36.26,3.13 v35.5,2.37
PMIC_INT  (1 unrouted)
PREVGH  (via drill 0.35)
  Top 0.152: 14.92,14.87 16.14,14.87 21.17,9.84 D7.1 | 14.92,14.87 EPD_C9.2 | v10.35,13.19 11.11,13.19 J3.21 | 14.92,14.87 v14.92,14.26
  Bottom 0.152: v10.35,13.19 12.48,13.19 12.94,13.65 14.31,13.65 v14.92,14.26
PREVGL
  Top 0.152: 14.31,11.97 14.31,12.28 EPD_C11.2 | 14.31,11.97 14.16,11.82 12.03,11.82 11.57,12.28 11.26,12.28 J3.23 | 14.31,11.97 17.21,9.08 21.93,9.08 22.24,9.38 22.24,10.6 24.68,13.04 24.68,13.5 D1.2
RESE  (via drill 0.35)
  Top 0.152: R1_EP_DR1.2 25.59,19.59 25.9,19.59 28.18,17.31 31.08,17.31 31.38,17.61 31.38,19.9 30.16,21.12 30.16,21.58 28.49,23.25 Q3.2 28.33,23.25 27.57,23.25 26.5,24.32 v26.5,25.08 | v20.1,27.37 16.75,27.37 13.7,24.32 13.7,23.71 12.33,22.34 11.26,22.34 J3.3
  Bottom 0.152: v20.1,27.37 20.56,27.37 21.02,27.82 22.85,27.82 23,27.98 23.61,27.98 v26.5,25.08
RESET  (2 unrouted)
SCL  (via drill 0.35)  (2 unrouted)
  Top 0.152: v19.65,21.88 16.75,24.78 16.75,25.99 R4.2 | v32.14,17.77 32.6,17.77 33.52,16.85 33.97,16.85 38.85,11.97 44.79,11.97 46.32,13.5 TP_SCL.TP 46.47,13.65 47.38,13.65 51.65,17.92 51.65,25.69 50.43,26.91 50.43,29.5 48.45,31.48 R17.2 48.45,32.4 | v42.05,32.4 43.73,32.4 IC3.12
  Bottom 0.152: v19.65,21.88 21.48,20.05 21.93,20.05 24.17,17.82 26.46,17.82 26.51,17.77 27.57,17.77 | v32.14,17.77 27.57,17.77 | v42.05,32.4 40.98,32.4 40.83,32.55 36.41,32.55 27.57,23.71 27.57,17.77
SCL/1.4C  (via drill 0.35)
  Top 0.152: v13.86,29.5 13.86,29.35 14.77,28.43 14.92,28.43 IC2.C1 | v18.73,32.7 18.28,33.16 17.82,33.16 U2.7
  Bottom 0.152: v18.73,32.7 16.44,30.41 16.04,30.41 15.13,29.5 v13.86,29.5
SDA  (via drill 0.35)  (2 unrouted)
  Top 0.152: v35.34,17.77 33.06,20.05 33.06,23.4 34.89,25.23 35.04,25.23 U1.P$L1 | TP_SDA.TP v40.98,10.91 | v40.83,6.95 40.98,6.79 40.98,6.03 R2.2 | v43.12,30.11 44.34,31.33 44.34,31.79 IC3.2 | v5.02,29.35 4.56,29.8 4.56,30.87 4.86,31.18 5.02,31.18 IC1.C1 | R18.2 29.6,3.36 29.67,3.36 29.8,3.49 29.8,4.61 v31.08,5.88
  Bottom 0.152: 35.34,17.46 35.34,17.31 39.15,13.5 39.15,12.74 40.83,11.06 | 40.83,11.06 v40.83,6.95 32.14,6.95 v31.08,5.88 | 40.83,11.06 v40.98,10.91 | v43.12,30.11 42.05,30.11 40.83,28.89 40.83,22.95 35.34,17.46 | 35.34,17.46 v35.34,17.77 | v5.02,29.35 5.32,29.04 5.32,28.89 8.83,25.39 9.77,25.39 10.91,24.24 11.65,24.24 19.04,16.85 20.97,16.85
  other vias: 26.21,17.21
SDA/1.4C  (1 unrouted)
SWDCLK  (via drill 0.35)  (1 unrouted)
  Top 0.152: v40.68,17.31 40.68,18.22 41.9,19.44 41.9,21.42 41.14,22.18 41.14,22.49 41.44,22.8 41.59,22.8 U1.P$AA24 | v46.62,11.37 46.62,10.3 47.08,9.84 TP_SWDCLK.TP
  Bottom 0.152: v46.62,11.37 v40.68,17.31
SWDIO  (via drill 0.35)  (1 unrouted)
  Top 0.152: v41.29,15.78 41.29,18.38 42.2,19.29 42.2,21.73 41.59,22.34 U1.P$AC24 | v45.86,6.95 46.16,6.95 47.08,6.03 TP_SWDIO.TP
  Bottom 0.152: v41.29,15.78 41.29,11.97 45.86,7.4 v45.86,6.95
SWO  (via drill 0.35)
  Top 0.152: v40.37,21.12 40.53,21.27 40.53,21.73 U1.P$AD22 | v49.21,13.65 50.89,13.65 TP_SWO.TP
  Bottom 0.152: v40.37,21.12 42.35,19.14 43.73,19.14 v49.21,13.65
VBAT
  Top 0.152: IC1.C2 6.85,31.18 7.3,31.63 7.3,32.24 7,32.55 3.8,32.55 3.04,31.79 C37.2
VBAT/1.2A  (via drill 0.35)
  Top 0.152: 15.07,32.09 16.14,31.02 19.34,31.02 19.49,31.18 19.49,31.33 C27.2 | 15.07,32.09 15.07,32.55 15.23,32.7 15.68,32.7 U2.3 15.68,32.85 15.68,33.16 U2.2 | v10.66,29.2 11.11,28.74 11.11,24.37 v10.52,23.78 | 15.07,32.09 v15.07,31.63 | TP_VBAT1.TP 51.5,9.69 48.91,9.69 46.77,7.55 34.28,7.55 33.82,7.1 v27.42,7.1
  Bottom 0.152: v27.42,7.1 27.42,7.55 16.75,18.22 16.75,18.68 11.66,23.78 v10.52,23.78 | v10.66,29.2 12.64,29.2 v15.07,31.63
VBUS/1.5D  (2 unrouted)
  Top 0.152: C42.1 38.09,33.77 38.09,32.7 C43.1 37.93,32.7 35.8,32.7 D8.5
VBUS/2.6D  (via drill 0.35)  (1 unrouted)
  Top 0.152: v6.69,31.94 5.47,31.94 IC1.A2 | v8.22,30.87 8.83,30.26 C38.1 | v30.62,30.72 30.77,30.87 38.85,30.87 39.31,31.33 C21.1 | v20.56,31.79 v23.76,31.79
  Bottom 0.152: v6.69,31.94 7.15,31.94 v8.22,30.87 10.66,33.31 19.04,33.31 v20.56,31.79 | v30.62,30.72 29.55,30.72 28.49,31.79 v23.76,31.79
VREG  (via drill 0.35)  (2 unrouted)
  Top 0.152: 20.1,5.73 20.41,5.73 IC9.A2 20.56,5.73 20.87,5.73 IC9.A3 | 16.45,6.64 19.19,6.64 20.1,5.73 | 16.45,6.64 16.29,6.64 15.68,6.03 15.68,5.88 C39.1 15.53,5.73 11.42,5.73 9.13,3.44 TP2.TP | 20.1,5.73 IC9.A1 | v9.28,24.78 8.37,25.69 5.63,25.69 C24.2 | 16.45,6.64 v16.45,8.16
  Bottom 0.152: v16.45,8.16 16.45,18.53 14.16,20.81 12.62,20.81 9.91,23.52 9.91,24.15 v9.28,24.78